# EAGLE design fasciaMainBoard_V0 (EAGLE 9.5.1)
NOVAXR-MAIN-BOARD: V1; REV: 1

## Sheet 1 of 2
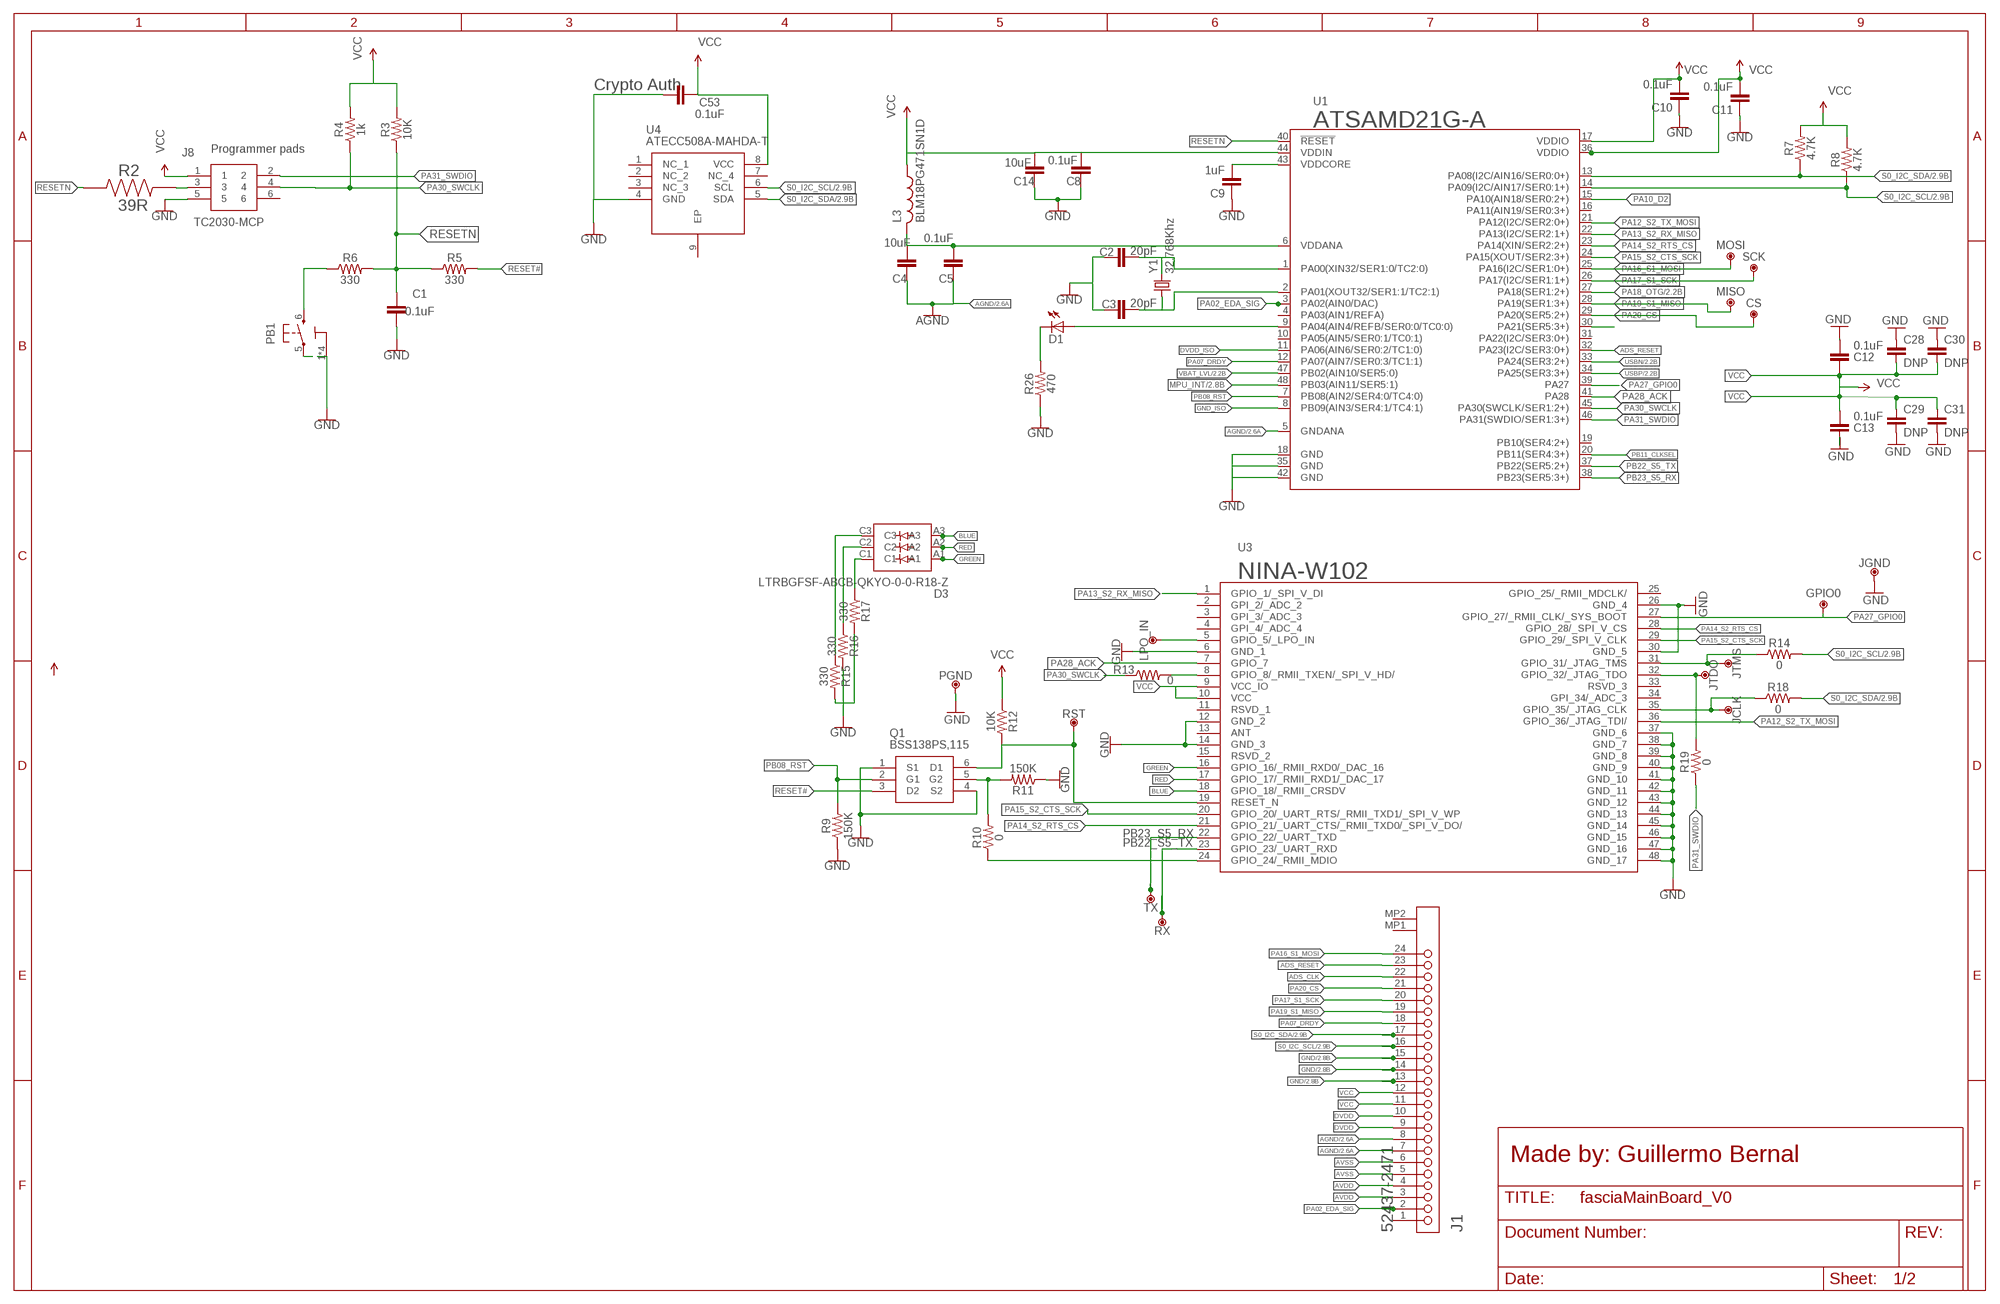
[diagram p0: schematic, sheet 1]
FRAME1 (FRAME_B_L): REV: 0

### Parts
C1  0.1uF  0.1UF-0402T-16V-10%  [0402-TIGHT]
C2  20pF  20PF-0402T-16V-10%  [0402-TIGHT]
C3  20pF  20PF-0402T-16V-10%  [0402-TIGHT]
C4  10uF  10UF-0603-6.3V-20%  [0603]
C5  0.1uF  0.1UF-0402T-16V-10%  [0402-TIGHT]
C8  0.1uF  0.1UF-0402T-16V-10%  [0402-TIGHT]
C9  1uF  1UF-0402T-16V-10%  [0402-TIGHT]
C10  0.1uF  0.1UF-0402T-16V-10%  [0402-TIGHT]
C11  0.1uF  0.1UF-0402T-16V-10%  [0402-TIGHT]
C12  0.1uF  0.1UF-0402T-16V-10%  [0402-TIGHT]
C13  0.1uF  0.1UF-0402T-16V-10%  [0402-TIGHT]
C14  10uF  10UF-0603-6.3V-20%  [0603]
C28  DNP  CDNP-0402  [0402-1005X55N]
C29  DNP  CDNP-0402  [0402-1005X55N]
C30  DNP  C-DNP-0603  [0603-1608X90N]
C31  DNP  C-DNP-0603  [0603-1608X90N]
C53  0.1uF  0.1UF-0402T-16V-10%  [0402-TIGHT]
CS  DNP  TPTP-0.8MM  [TP-0.8MM]
D1  LEDCHIPLED_0603  [CHIPLED_0603]
D3  LTRBGFSF-ABCB-QKYO-0-0-R18-Z  [PLCC-6]
GPIO0  DNP  TPTP-0.8MM  [TP-0.8MM]
J1  MOLEX_52437-2471MOLEX_52437-2471_0_0  [MOLEX_52437-2471_0]
J8  TC2030-MCP  [TC2030MCP]
JCLK  DNP  TPTP-0.8MM  [TP-0.8MM]
JGND  DNP  TPTP-0.8MM  [TP-0.8MM]
JTDO  DNP  TPTP-0.8MM  [TP-0.8MM]
JTMS  DNP  TPTP-0.8MM  [TP-0.8MM]
L3  BLM18PG471SN1D  [BEADC1608X95N]
LPO_IN  DNP  TPTP-0.8MM  [TP-0.8MM]
MISO  DNP  TPTP-0.8MM  [TP-0.8MM]
MOSI  DNP  TPTP-0.8MM  [TP-0.8MM]
PB1  PTS820  TACTILE1PTS820-NH  [C&K_PTS820_NO_HOLES]
PGND  DNP  TPTP-0.8MM  [TP-0.8MM]
Q1  BSS138PS,115  [SOT65P210X110-6N]
R2  39R  RC0402FR-0739RL  [RESC1005X40N]
R3  10K  [0402-TIGHT]
R4  1k  1K  [0402-TIGHT]
R5  330  [0402-TIGHT]
R6  330  [0402-TIGHT]
R7  4.7K  [0402-TIGHT]
R8  4.7K  [0402-TIGHT]
R9  150K  100K  [0402-TIGHT]
R10  0  [0402-TIGHT]
R11  150K  100K  [0402-TIGHT]
R12  10K  [0402-TIGHT]
R13  0  [0402-TIGHT]
R14  0  [0402-TIGHT]
R15  330  [0402-TIGHT]
R16  330  [0402-TIGHT]
R17  330  [0402-TIGHT]
R18  0  [0402-TIGHT]
R19  0  [0402-TIGHT]
R26  470  [0402-TIGHT]
RST  DNP  TPTP-0.8MM  [TP-0.8MM]
RX  DNP  TPTP-0.8MM  [TP-0.8MM]
SCK  DNP  TPTP-0.8MM  [TP-0.8MM]
TX  DNP  TPTP-0.8MM  [TP-0.8MM]
U1  ATSAMD21G-A  [TQFP-48]
U3  NINA-W102  [NINAW102]
U4  ATECC508A-MAHDA-T  [SON50P300X200X60-9N]
Y1  32.768Khz  ECS-.327-12.5-34B-TR  [ECX-31B]

### Nets
ADS_CLK: J1.22
ADS_RESET: J1.23 U1.32(PA23(I2C/SER3:0+))
AGND: C4.1 C5.1 J1.7 J1.8 U1.5(GNDANA) ; also sheet 2
AVDD: J1.3 J1.4 ; also sheet 2
AVSS: J1.5 J1.6 ; also sheet 2
BLUE: D3.A3 U3.18(GPIO_18/_RMII_CRSDV)
DVDD: J1.9 J1.10 ; also sheet 2
DVDD_ISO: U1.11(PA06(AIN6/SER0:2/TC1:0))
GND: C1.2 C2.1 C3.1 C8.1 C9.1 C10.1 C11.1 C12.2 C13.1 C14.1 C28.1 C29.2 C30.1 C31.2 C53.2 J1.13 J1.14 J1.15 J8.5 JGND.X PB1.1 PB1.2 PB1.3 PB1.4 PB1.5 PGND.X Q1.1(S1) Q1.4(S2) R9.1 R11.1 R15.2 R16.2 R17.2 R26.1 U1.18(GND) U1.35(GND) U1.42(GND) U3.6(GND_1) U3.12(GND_2) U3.14(GND_3) U3.26(GND_4) U3.30(GND_5) U3.37(GND_6) U3.38(GND_7) U3.39(GND_8) U3.40(GND_9) U3.41(GND_10) U3.42(GND_11) U3.43(GND_12) U3.44(GND_13) U3.45(GND_14) U3.46(GND_15) U3.47(GND_16) U3.48(GND_17) U4.4(GND) ; also sheet 2
GND_ISO: U1.8(PB09(AIN3/SER4:1/TC4:1))
GREEN: D3.A1 U3.16(GPIO_16/_RMII_RXD0/_DAC_16)
MPU_INT: U1.48(PB03(AIN11/SER5:1)) ; also sheet 2
N$1: J8.3 R2.2
N$3: PB1.6 R6.1
N$4: C2.2 U1.1(PA00(XIN32/SER1:0/TC2:0)) Y1.2
N$6: C3.2 U1.2(PA01(XOUT32/SER1:1/TC2:1)) Y1.1
N$8: Q1.5(G2) R10.2 R11.2
N$9: R10.1 U3.24(GPIO_24/_RMII_MDIO)
N$10: C9.2 U1.43(VDDCORE)
N$11: R13.2 U3.8(GPIO_8/_RMII_TXEN/_SPI_V_HD/)
N$12: Q1.6(D1) R12.2 RST.X U3.19(RESET_N)
N$13: D1.C R26.2
N$15: D1.A U1.9(PA04(AIN4/REFB/SER0:0/TC0:0))
N$16: D3.C1 R17.1
N$17: D3.C2 R16.1
N$18: D3.C3 R15.1
N$19: JTMS.X R14.1 U3.31(GPIO_31/_JTAG_TMS)
N$20: JTDO.X R19.2 U3.32(GPIO_32/_JTAG_TDO)
N$21: JCLK.X R18.1 U3.35(GPIO_35/_JTAG_CLK)
N$23: LPO_IN.X U3.5(GPIO_5/_LPO_IN)
PA02_EDA_SIG: J1.2 U1.3(PA02(AIN0/DAC))
PA07_DRDY: J1.18 U1.12(PA07(AIN7/SER0:3/TC1:1))
PA10_D2: U1.15(PA10(AIN18/SER0:2+))
PA12_S2_TX_MOSI: U1.21(PA12(I2C/SER2:0+)) U3.36(GPIO_36/_JTAG_TDI/)
PA13_S2_RX_MISO: U1.22(PA13(I2C/SER2:1+)) U3.1(GPIO_1/_SPI_V_DI)
PA14_S2_RTS_CS: U1.23(PA14(XIN/SER2:2+)) U3.21(GPIO_21/_UART_CTS/_RMII_TXD0/_SPI_V_DO/) U3.28(GPIO_28/_SPI_V_CS)
PA15_S2_CTS_SCK: U1.24(PA15(XOUT/SER2:3+)) U3.20(GPIO_20/_UART_RTS/_RMII_TXD1/_SPI_V_WP) U3.29(GPIO_29/_SPI_V_CLK)
PA16_S1_MOSI: J1.24 MOSI.X U1.25(PA16(I2C/SER1:0+))
PA17_S1_SCK: J1.20 SCK.X U1.26(PA17(I2C/SER1:1+))
PA18_OTG: U1.27(PA18(SER1:2+)) ; also sheet 2
PA19_S1_MISO: J1.19 MISO.X U1.28(PA19(SER1:3+))
PA20_CS: CS.X J1.21 U1.29(PA20(SER5:2+))
PA21_CS1: U1.30(PA21(SER5:3+))
PA27_GPIO0: GPIO0.X U1.39(PA27) U3.27(GPIO_27/_RMII_CLK/_SYS_BOOT)
PA28_ACK: U1.41(PA28) U3.7(GPIO_7)
PA30_SWCLK: J8.4 R4.1 R13.1 U1.45(PA30(SWCLK/SER1:2+))
PA31_SWDIO: J8.2 R19.1 U1.46(PA31(SWDIO/SER1:3+))
PB08_RST: Q1.2(G1) R9.2 U1.7(PB08(AIN2/SER4:0/TC4:0))
PB11_CLKSEL: U1.20(PB11(SER4:3+))
PB22_S5_TX: RX.X U1.37(PB22(SER5:2+)) U3.23(GPIO_23/_UART_RXD)
PB23_S5_RX: TX.X U1.38(PB23(SER5:3+)) U3.22(GPIO_22/_UART_TXD)
RED: D3.A2 U3.17(GPIO_17/_RMII_RXD1/_DAC_17)
RESET#: Q1.3(D2) R5.2
RESETN: C1.1 R2.1 R3.1 R5.1 R6.2 U1.40(!RESET!)
S0_I2C_SCL: J1.16 R8.1 R14.2 U1.14(PA09(I2C/AIN17/SER0:1+)) U4.6(SCL) ; also sheet 2
S0_I2C_SDA: J1.17 R7.1 R18.2 U1.13(PA08(I2C/AIN16/SER0:0+)) U4.5(SDA) ; also sheet 2
USBN: U1.33(PA24(SER3:2+)) ; also sheet 2
USBP: U1.34(PA25(SER3:3+)) ; also sheet 2
VBAT_LVL: U1.47(PB02(AIN10/SER5:0)) ; also sheet 2
VCC: C8.2 C10.2 C11.2 C12.1 C13.2 C14.2 C28.2 C29.1 C30.2 C31.1 C53.1 J1.11 J1.12 J8.1 L3.1 R3.2 R4.2 R7.2 R8.2 R12.1 U1.17(VDDIO) U1.36(VDDIO) U1.44(VDDIN) U3.9(VCC_IO) U3.10(VCC) U4.8(VCC) ; also sheet 2
VDDANA: C4.2 C5.2 L3.2 U1.6(VDDANA)
Unconnected: J1.1 J1.MP1 J1.MP2 J8.6 U1.4(PA03(AIN1/REFA)) U1.10(PA05(AIN5/SER0:1/TC0:1)) U1.16(PA11(AIN19/SER0:3+)) U1.19(PB10(SER4:2+)) U1.31(PA22(I2C/SER3:0+)) U3.2(GPI_2/_ADC_2) U3.3(GPI_3/_ADC_3) U3.4(GPI_4/_ADC_4) U3.11(RSVD_1) U3.13(ANT) U3.15(RSVD_2) U3.25(GPIO_25/_RMII_MDCLK/) U3.33(RSVD_3) U3.34(GPI_34/_ADC_3) U4.1(NC_1) U4.2(NC_2) U4.3(NC_3) U4.7(NC_4) U4.9(EP)

### Notes on the sheet
- Crypto Auth
- Programmer pads
- Made by: Guillermo Bernal

## Sheet 2 of 2
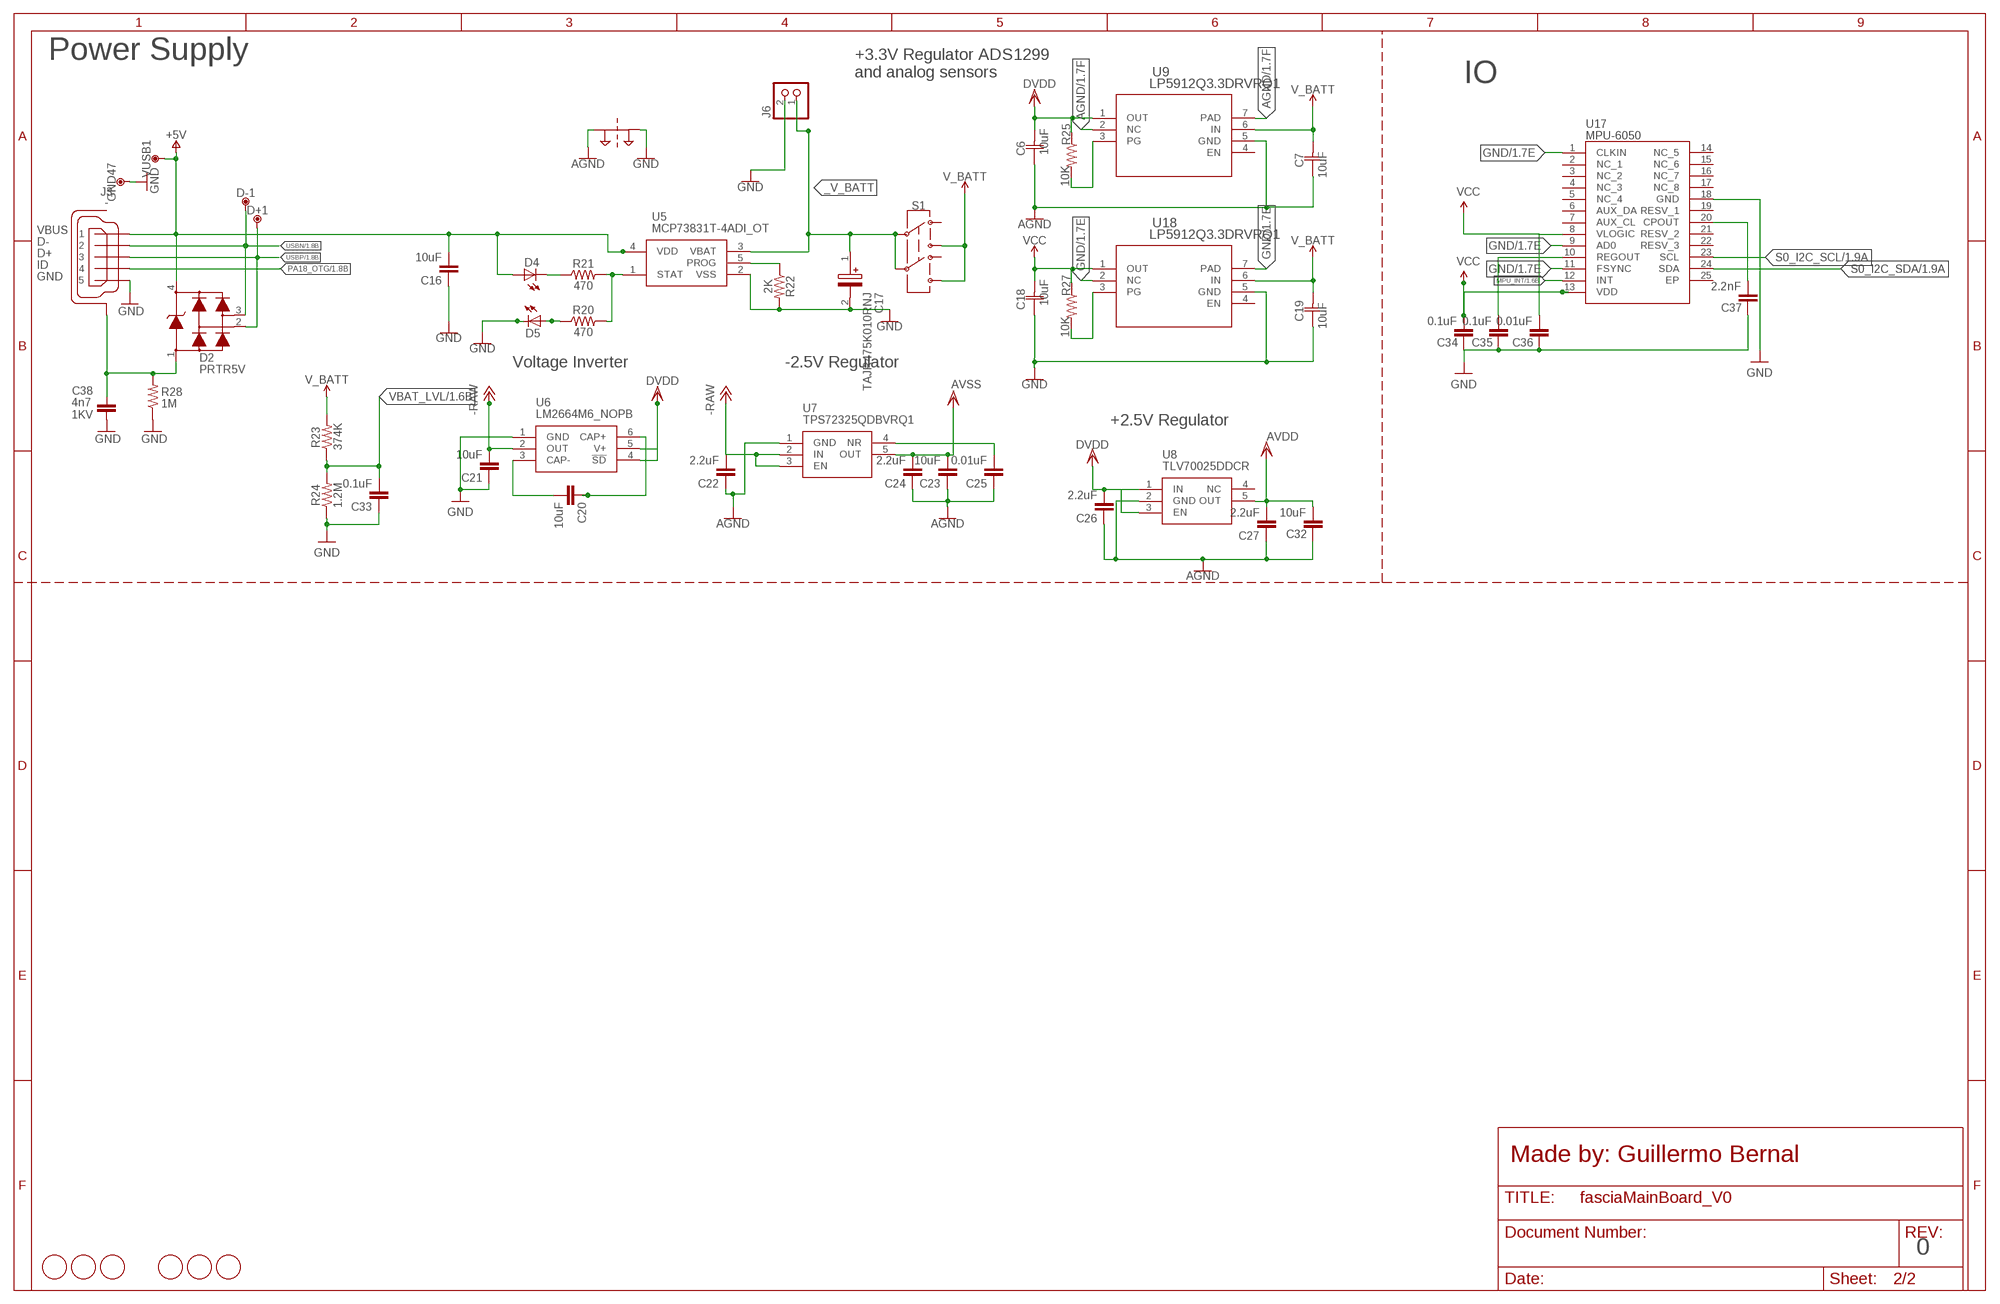
[diagram p1: schematic, sheet 2]
FRAME2 (FRAME_B_L): REV: 0

### Parts
C6  10uF  CL10B106MQ8NRNCCAP_CL10-L  [CAP_CL10-L]
C7  10uF  CL10B106MQ8NRNCCAP_CL10-L  [CAP_CL10-L]
C16  10uF  10UF-0603-6.3V-20%  [0603]
C17  TAJR475K010RNJ  [CAPPM2014X120N]
C18  10uF  CL10B106MQ8NRNCCAP_CL10-L  [CAP_CL10-L]
C19  10uF  CL10B106MQ8NRNCCAP_CL10-L  [CAP_CL10-L]
C20  10uF  10UF-0603-6.3V-20%  [0603]
C21  10uF  10UF-0603-6.3V-20%  [0603]
C22  2.2uF  2.2UF-0402T-16V-10%  [0402-TIGHT]
C23  10uF  10UF-0603-6.3V-20%  [0603]
C24  2.2uF  2.2UF-0402T-16V-10%  [0402-TIGHT]
C25  0.01uF  0.01UF-0402T-16V-10%  [0402-TIGHT]
C26  2.2uF  2.2UF-0402T-16V-10%  [0402-TIGHT]
C27  2.2uF  2.2UF-0402T-16V-10%  [0402-TIGHT]
C32  10uF  10UF-0603-6.3V-20%  [0603]
C33  0.1uF  0.1UF-0402T-16V-10%  [0402-TIGHT]
C34  0.1uF  0.1UF-0402T-16V-10%  [0402-TIGHT]
C35  0.1uF  0.1UF-0402T-16V-10%  [0402-TIGHT]
C36  0.01uF  0.01UF-0402T-16V-10%  [0402-TIGHT]
C37  2.2nF  2.2NF-0402T-16V-10%  [0402-TIGHT]
C38  4n7  C4.7NF-0805  [0805-R2013X50N]
D2  PRTR5V  PRTR5V0U2X,215  [SOT190P230X110-4N]
D4  LEDCHIPLED_0603  [CHIPLED_0603]
D5  LEDCHIPLED_0603  [CHIPLED_0603]
D+1  DNP  TPTP-1.00MM  [TP-1.00MM]
D-1  DNP  TPTP-1.00MM  [TP-1.00MM]
FD1  DNP  FIDUCIAL-1.5MM  [FD-1-1.5]
FD2  DNP  FIDUCIAL-1.5MM  [FD-1-1.5]
FD3  DNP  FIDUCIAL-1.5MM  [FD-1-1.5]
FD4  DNP  FIDUCIAL-1.5MM  [FD-1-1.5]
FD5  DNP  FIDUCIAL-1.5MM  [FD-1-1.5]
FD6  DNP  FIDUCIAL-1.5MM  [FD-1-1.5]
GND47  DNP  TPTP-1.00MM  [TP-1.00MM]
J3  -  USB-MICRO  [ZX62-AB-5PA]
J6  JST_2PIN-SMT-RA  [JST-PH-2-SMT-RA]
R20  470  [0402-TIGHT]
R21  470  [0402-TIGHT]
R22  2K  [0402-TIGHT]
R23  374K  [0402-TIGHT]
R24  1.2M  1.2M-0402-1/10W-1%  [0402]
R25  10K  [0402-TIGHT]
R27  10K  [0402-TIGHT]
R28  1M  [0402-TIGHT]
S1  SWITCH-DPDT-SMD-AYZ0202  [SWITCH_DPDT_SMD_AYZ0202]
SUPPLY1  2PT_GND_TIE  [2PT_GND_TIE]
U5  MCP73831T-4ADI_OT  [SOT95P270X145-5N]
U6  LM2664M6_NOPB  [SOT95P280X145-6N]
U7  TPS72325QDBVRQ1  [SOT96P230X110-5N]
U8  TLV70025DDCR  [SOT95P280X110-5N]
U9  LP5912Q3.3DRVRQ1  [DRV0006A]
U17  MPU-6050  [MPU6050]
U18  LP5912Q3.3DRVRQ1  [DRV0006A]
VUSB1  DNP  TPTP-1.00MM  [TP-1.00MM]

### Nets
+5V: C16.2 D2.4 D4.A J3.1 U5.4(VDD) VUSB1.X
-RAW: C21.2 C22.2 U6.2(OUT) U7.2(IN) U7.3(EN)
_V_BATT: C17.1(+) J6.1 S1.2 S1.5 U5.3(VBAT)
AGND: C6.1 C7.1 C22.1 C23.1 C24.1 C25.1 C26.1 C27.1 C32.1 SUPPLY1.P$1 U7.1(GND) U8.2(GND) U9.2(NC) U9.5(GND) U9.7(PAD) ; also sheet 1
AVDD: C27.2 C32.2 U8.5(OUT) ; also sheet 1
AVSS: C23.2 C24.2 U7.5(OUT) ; also sheet 1
DVDD: C6.2 C26.2 R25.1 U6.4(!SD) U6.5(V+) U8.1(IN) U8.3(EN) U9.1(OUT) ; also sheet 1
GND: C16.1 C17.2(-) C18.1 C19.1 C21.1 C33.1 C34.1 C35.1 C36.1 C37.1 C38.2 D5.C GND47.X J3.5 J6.2 R22.2 R24.1 R28.1 SUPPLY1.P$2 U5.2(VSS) U6.1(GND) U17.1(CLKIN) U17.9(AD0) U17.11(FSYNC) U17.18(GND) U18.2(NC) U18.5(GND) U18.7(PAD) ; also sheet 1
MPU_INT: U17.12(INT) ; also sheet 1
N$2: R27.2 U18.3(PG)
N$7: R25.2 U9.3(PG)
N$25: D4.C R21.1
N$28: R20.2 R21.2 U5.1(STAT)
N$30: R22.1 U5.5(PROG)
N$31: C20.2 U6.3(CAP-)
N$32: C20.1 U6.6(CAP+)
N$33: C25.2 U7.4(NR)
N$37: C35.2 U17.10(REGOUT)
N$39: C37.2 U17.20(CPOUT)
N$40: C38.1 D2.1 J3.6(SH) J3.7(SH) J3.8(SH) J3.9(SH) J3.10(SH) J3.11(SH) R28.2
N$42: D5.A R20.1
PA18_OTG: J3.4 ; also sheet 1
S0_I2C_SCL: U17.23(SCL) ; also sheet 1
S0_I2C_SDA: U17.24(SDA) ; also sheet 1
USBN: D2.3 D-1.X J3.2 ; also sheet 1
USBP: D2.2 D+1.X J3.3 ; also sheet 1
V_BATT: C7.2 C19.2 R23.2 S1.3 S1.6 U9.6(IN) U18.6(IN)
VBAT_LVL: C33.2 R23.1 R24.2 ; also sheet 1
VCC: C18.2 C34.2 C36.2 R27.1 U17.8(VLOGIC) U17.13(VDD) U18.1(OUT) ; also sheet 1
Unconnected: S1.1 S1.4 U8.4(NC) U9.4(EN) U17.2(NC_1) U17.3(NC_2) U17.4(NC_3) U17.5(NC_4) U17.6(AUX_DA) U17.7(AUX_CL) U17.14(NC_5) U17.15(NC_6) U17.16(NC_7) U17.17(NC_8) U17.19(RESV_1) U17.21(RESV_2) U17.22(RESV_3) U17.25(EP) U18.4(EN)

### Notes on the sheet
- Power Supply
- +3.3V Regulator ADS1299 
  and analog sensors
- IO
- Voltage Inverter | -2.5V Regulator
- +2.5V Regulator
- 374K
- Made by: Guillermo Bernal

## Library data of the parts
C1 C5 C8 C10-C13 C33-C35 C53 = novaXR:0.1UF: 0.1µF ceramic capacitors A capacitor is a passive two-terminal electrical component used to store electrical energy temporarily in an electric field.; PROD_ID: CAP-12416
C2 C3 = novaXR:20PF: 20pF ceramic capacitors A capacitor is a passive two-terminal electrical component used to store electrical energy temporarily in an electric field.; PROD_ID: CAP-12416; VALUE: 0.1uF
C4 C14 C16 C20 C21 C23 C32 = SparkFun-Capacitors:10UF: 10.0µF ceramic capacitors A capacitor is a passive two-terminal electrical component used to store electrical energy temporarily in an electric field.; PROD_ID: CAP-11015
C6 C7 C18 C19 = Lp5912Q3.3DRV:CL10B106MQ8NRNC; MANUFACTURER_PART_NUMBER: CL10B106MQ8NRNC; VENDOR: Samsung
C9 = novaXR:1UF: 1µF ceramic capacitors A capacitor is a passive two-terminal electrical component used to store electrical energy temporarily in an electric field.; PROD_ID: CAP-12416
C17 = SamacSys_Parts:TAJR475K010RNJ: AVX 4.7uF SMD Solid MnO2 Tantalum Electrolytic Capacitor, 10 V dc +/-10%, TAJ Series Source: Datasheet; ALLIED_NUMBER: 70475142; ALLIED_PRICE-STOCK: https://www.alliedelec.com/avx-tajr475k010rnj/70475142/; DESCRIPTION: AVX 4.7uF SMD Solid MnO2 Tantalum Electrolytic Capacitor, 10 V dc +/-10%, TAJ Series; HEIGHT: 1.2mm; MANUFACTURER_NAME: AVX; MANUFACTURER_PART_NUMBER: TAJR475K010RNJ; MOUSER_PART_NUMBER: 581-TAJR475K010R; MOUSER_PRICE-STOCK: https://www.mouser.com/Search/Refine.aspx?Keyword=581-TAJR475K010R; RS_PART_NUMBER: 1355409P; RS_PRICE-STOCK: http://uk.rs-online.com/web/p/products/1355409P
C22 C24 C26 C27 = novaXR:2.2UF: 2.2uF ceramic capacitors A capacitor is a passive two-terminal electrical component used to store electrical energy temporarily in an electric field.; PROD_ID: CAP-12416
C25 C36 = novaXR:0.01UF: 0.01µF ceramic capacitors A capacitor is a passive two-terminal electrical component used to store electrical energy temporarily in an electric field.; PROD_ID: CAP-12416
C28-C31 = Arduino-rcl:C: SMD Capacitor; CODE-ARDUINO: DNP; DATASHEET: DNP; DISTRIBUTOR-LINK: DNP; DISTRIBUTOR-PN: DNP; MANUFACTURER: DNP; MANUFACTURER-PN: DNP
C37 = novaXR:2.2NF: 2.2uF ceramic capacitors A capacitor is a passive two-terminal electrical component used to store electrical energy temporarily in an electric field.; PROD_ID: CAP-12416
C38 = Arduino-rcl:C: SMD Capacitor; CODE-ARDUINO: 0689; DATASHEET: http://www.kemet.com/Lists/ProductCatalog/Attachments/40/KEM_C1010_X7R_HV_SMD.pdf; DISTRIBUTOR-LINK: www.kemet.com/docfinder?Partnumber=C0805C472KDRACTU; DISTRIBUTOR-PN: 399-6738-1-ND; MANUFACTURER: Kemet; MANUFACTURER-PN: C0805C472KDRACTU; VOLTAGE: 1KV
CS D+1 D-1 GND47 GPIO0 JCLK JGND JTDO JTMS LPO_IN MISO MOSI PGND RST RX SCK TX VUSB1 = Arduino-utility:TP: Testpoint; CODE-ARDUINO: DNP; DATASHEET: DNP; DISTRIBUTOR-LINK: DNP; DISTRIBUTOR-PN: DNP; MANUFACTURER: DNP; MANUFACTURER-PN: DNP
D1 D4 D5 = adafruit:LED: LED OSRAM: - CHIPLED LG R971, LG N971, LY N971, LG Q971, LY Q971, LO R971, LY R971 LH N974, LH R974 LS Q976, LO Q976, LY Q976 LO Q996 - Hyper CHIPLED LW Q18S LB Q993, LB Q99A, LB R99A - SideLED LS A670, LO A670, LY A670, LG A670, LP A670 LB A673, LV A673, LT A673, LW A673 LH A674 LY A675 LS A676, LA A676, LO A676, LY A676, LW A676 LS A679, LY A679, LG A679 - Hyper Micro SIDELED® LS Y876, LA Y876, LO Y876, LY Y876 LT Y87S - SmartLED LW L88C, LW L88S LB L89C, LB L89S, LG L890 LS L89K, LO L89K, LY L89K LS L896, LA L896, LO L896, LY L896 - TOPLED LS T670, LO T670, LY T670, LG T670, LP T670 LSG T670, LSP T670, LSY T670, LOP T670, LYG T670 LG T671, LOG T671, LSG T671 LB T673, LV T673, LT T673, LW T673 LH T674 LS T676, LA T676, LO T676, LY T676, LB T676, LH T676, LSB T676, LW T676 LB T67C, LV T67C, LT T67C, LS T67K, LO T67K, LY T67K, LW E67C LS E67B, LA E67B, LO E67B, LY E67B, LB E67C, LV E67C, LT E67C LW T67C LS T679, LY T679, LG T679 LS T770, LO T770, LY T770, LG T770, LP T770 LB T773, LV T773, LT T773, LW T773 LH T774 LS E675, LA E675, LY E675, LS T675 LS T776, LA T776, LO T776, LY T776, LB T776 LHGB T686 LT T68C, LB T68C - Hyper Mini TOPLED® LB M676 - Mini TOPLED Santana® LG M470 LS M47K, LO M47K, LY M47K Source: http://www.osram.convergy.de/
D2 = Arduino-diodes:PRTR5V0U2X,215: USB ESD protection; CODE-ARDUINO: 2209; DATASHEET: http://www.nxp.com/documents/data_sheet/PRTR5V0U2X.pdf; DISTRIBUTOR-LINK: http://www.digikey.com/product-detail/en/nxp-semiconductors/PRTR5V0U2X,215/568-4140-1-ND/1589981; DISTRIBUTOR-PN: 568-4140-1-ND; MANUFACTURER: NXP; MANUFACTURER-PN: PRTR5V0U2X,215
D3 = SamacSys_Parts:LTRBGFSF-ABCB-QKYO-0-0-R18-Z: LED RGB DIFFUSED 6SMD Source: Datasheet; DESCRIPTION: LED RGB DIFFUSED 6SMD; HEIGHT: mm; MANUFACTURER_NAME: OSRAM Opto Semiconductors; MANUFACTURER_PART_NUMBER: LTRBGFSF-ABCB-QKYO-0-0-R18-Z; MOUSER_PART_NUMBER: N/A; MOUSER_PRICE-STOCK: https://www.mouser.com/Search/Refine.aspx?Keyword=N%2FA
FD1-FD6 = Arduino-utility:FIDUCIAL: Fiducial mount; CODE-ARDUINO: DNP; DATASHEET: DNP; DISTRIBUTOR-LINK: DNP; DISTRIBUTOR-PN: DNP; MANUFACTURER: DNP; MANUFACTURER-PN: DNP
J1 = Molex - 52437-2471:MOLEX_52437-2471: MOLX-52437-2471; CIIVA_IDS: 605212; CIRCUITS_LOADED: 24; COMPONENT_LINK_1_DESCRIPTION: Manufacturer URL; COMPONENT_LINK_1_URL: http://www.molex.com/molex/index.jsp; COMPONENT_LINK_3_DESCRIPTION: Package Specification; COMPONENT_LINK_3_URL: http://www.molex.com/pdm_docs/sd/524372471_sd.pdf; CONTACT_POSITION: Bottom; CURRENT_MAX_PER_CONTACT: 0.5A; DATASHEET: http://www.molex.com/webdocs/datasheets/pdf/en-us/0524372471_FFC_FPC_CONNECTORS.pdf; DURABILITY_MATING_CYCLES_MAX: 20; ENTRY_ANGLE: 90degrees Angle; FOOTPRINT_VARIANT_NAME_0: Manufacturer Recommended; IMPORTED: yes; IMPORTED_FROM: vault; IMPORT_TS: 1521869192; MATERIAL___METAL: Phosphor Bronze; MATERIAL___PLATING_MATING: Gold; MATERIAL___PLATING_TERMINATION: Gold; MF: Molex; MOUNTING_TECHNOLOGY: Surface Mount; MPN: 52437-2471; NUMBER_OF_ROWS: 1; ORIENTATION: Right Angle; PACKAGE: 52437-2471; PACKAGE_DESCRIPTION: 24-Lead FPC Connector, Pitch 0.5 mm; PACKAGE_VERSION: Rev. E, 07/2013; PACKING: Tape and Reel; PCB_LOCATOR: No; PCB_RETENTION: None; PITCH___MATING_INTERFACE: 0.50mm; POLARIZED_TO_PCB: Yes; PREFIX: J; RELEASE_DATE: 1411372502; ROHS: Yes; STACKABLE: No; VAULT_GUID: C435F480-C5D6-47A9-8B3E-1F527B5FE02A; VAULT_REVISION: D1E34D73-9D44-46B4-956C-D39459EFC8BE; VOLTAGE_MAX: 50V
J3 = Arduino-connectors:USB-MICRO: USB - micro AB USB 2.0 Receptacle Connector 5 Position Surface Mount, Right Angle, Horizontal; CODE-ARDUINO: 2219; DATASHEET: https://www.hirose.com/product/en/download_file/key_name/ZX/category/Catalog/doc_file_id/31704/?file_category_id=4&item_id=13&is_series=1; DISTRIBUTOR-LINK: http://www.digikey.com/product-detail/en/hirose-electric-co-ltd/ZX62-AB-5PA(31)/H125279CT-ND/5994741; DISTRIBUTOR-PN: H125279CT-ND; MANUFACTURER: Hirose; MANUFACTURER-PN: ZX62-AB-5PA(31)
J6 = adafruit:JST_2PIN: JST 2-Pin Connectors of various flavors SMT-RA (S2B-PH-SM4) 4UConnector #17311 SMT (B2B-PH-SM4) THM-RA (S2B-PH) THM (B2B-PH)
J8 = TC2030-MCP:TC2030-MCP: TC2030-MCP PCB FOOTPRINT,TC2030-MCP Source: Datasheet; ALLIED_NUMBER: 70547380; ALLIED_PRICE-STOCK: https://www.alliedelec.com/microchip-technology-inc-tc2030-mcp/70547380/; DESCRIPTION: TC2030-MCP PCB FOOTPRINT,TC2030-MCP; HEIGHT: 3mm; MANUFACTURER_NAME: Microchip; MANUFACTURER_PART_NUMBER: TC2030-MCP; MOUSER_PART_NUMBER: 579-TC2030-MCP; MOUSER_PRICE-STOCK: https://www.mouser.com/Search/Refine.aspx?Keyword=579-TC2030-MCP; RS_PART_NUMBER: 8252568; RS_PRICE-STOCK: http://uk.rs-online.com/web/p/products/8252568
L3 = SamacSys_Parts:BLM18PG471SN1D: Chip Ferrite Bead Source: Datasheet; DESCRIPTION: Chip Ferrite Bead; HEIGHT: 0.95mm; MANUFACTURER_NAME: Murata Electronics; MANUFACTURER_PART_NUMBER: BLM18PG471SN1D; MOUSER_PART_NUMBER: 81-BLM18PG471SN1D; MOUSER_PRICE-STOCK: https://www.mouser.com/Search/Refine.aspx?Keyword=81-BLM18PG471SN1D; RS_PART_NUMBER: 7241425P; RS_PRICE-STOCK: http://uk.rs-online.com/web/p/products/7241425P
PB1 = Arduino-pushbuttons:TACTILE1: Tactile Switch SPST-NO Top Actuated Surface Mount; CODE-ARDUINO: 0277; DATASHEET: http://www.ckswitches.com/media/1474/pts820.pdf; DISTRIBUTOR-LINK: https://www.digikey.com/product-detail/en/c-k/PTS820-J15M-SMTR-LFS/CKN10506CT-ND/4176681; DISTRIBUTOR-PN: PTS820 J25K SMTR LFS-ND; MANUFACTURER: C&K; MANUFACTURER-PN: PTS820 J25K SMTR LFS
Q1 = SamacSys_Parts:BSS138PS,115: Nexperia BSS138PS,115 Dual N-channel MOSFET, 320 mA, 60 V, 6-Pin SOT-363 Source: Datasheet; DESCRIPTION: Nexperia BSS138PS,115 Dual N-channel MOSFET, 320 mA, 60 V, 6-Pin SOT-363; HEIGHT: 1.1mm; MANUFACTURER_NAME: Nexperia; MANUFACTURER_PART_NUMBER: BSS138PS,115; MOUSER_PART_NUMBER: 771-BSS138PS115; MOUSER_PRICE-STOCK: https://www.mouser.com/Search/Refine.aspx?Keyword=771-BSS138PS115; RS_PART_NUMBER: 7920901P; RS_PRICE-STOCK: http://uk.rs-online.com/web/p/products/7920901P
R2 = RC0402FR-0739RL:RC0402FR-0739RL: Res Thick Film 0402 39 Ohm 1% 0.063W ?100ppm/?C Molded SMD Paper T/R; AVAILABILITY: Unavailable; DESCRIPTION: Surface Mount Thick Film Resistor, RC Series, 39 ohm, 63 mW, - 1%, 50 V, 0402 [1005 Metric]; MF: Yageo; MP: RC0402FR-0739RL; PACKAGE: 1005 Panasonic Electronic Components; PRICE: None
R3 R12 R25 R27 = novaXR:10K: 10KΩ resistor A resistor is a passive two-terminal electrical component that implements electrical resistance as a circuit element. Resistors act to reduce current flow, and, at the same time, act to lower voltage levels within circuits. - Wikipedia
R4 = novaXR:1K: 1KΩ resistor A resistor is a passive two-terminal electrical component that implements electrical resistance as a circuit element. Resistors act to reduce current flow, and, at the same time, act to lower voltage levels within circuits. - Wikipedia
R5 R6 R15-R17 = novaXR:330: 330Ω resistor A resistor is a passive two-terminal electrical component that implements electrical resistance as a circuit element. Resistors act to reduce current flow, and, at the same time, act to lower voltage levels within circuits. - Wikipedia
R7 R8 = novaXR:4.7K: 4.7KΩ resistor A resistor is a passive two-terminal electrical component that implements electrical resistance as a circuit element. Resistors act to reduce current flow, and, at the same time, act to lower voltage levels within circuits. - Wikipedia
R9 R11 = novaXR:100K: 150KΩ resistor A resistor is a passive two-terminal electrical component that implements electrical resistance as a circuit element. Resistors act to reduce current flow, and, at the same time, act to lower voltage levels within circuits. - Wikipedia
R10 R13 R14 R18 R19 = novaXR:0: 0Ω resistor A resistor is a passive two-terminal electrical component that implements electrical resistance as a circuit element. Resistors act to reduce current flow, and, at the same time, act to lower voltage levels within circuits. - Wikipedia
R20 R21 R26 = novaXR:470: 470Ω resistor A resistor is a passive two-terminal electrical component that implements electrical resistance as a circuit element. Resistors act to reduce current flow, and, at the same time, act to lower voltage levels within circuits. - Wikipedia
R22 = novaXR:2K: 2KΩ resistor A resistor is a passive two-terminal electrical component that implements electrical resistance as a circuit element. Resistors act to reduce current flow, and, at the same time, act to lower voltage levels within circuits. - Wikipedia
R23 = novaXR:374K: 374KΩ resistor A resistor is a passive two-terminal electrical component that implements electrical resistance as a circuit element. Resistors act to reduce current flow, and, at the same time, act to lower voltage levels within circuits. - Wikipedia
R24 = novaXR:1.2M: 1.2MΩ resistor A resistor is a passive two-terminal electrical component that implements electrical resistance as a circuit element. Resistors act to reduce current flow, and, at the same time, act to lower voltage levels within circuits. - Wikipedia
R28 = novaXR:1M: 1MΩ resistor A resistor is a passive two-terminal electrical component that implements electrical resistance as a circuit element. Resistors act to reduce current flow, and, at the same time, act to lower voltage levels within circuits. - Wikipedia
S1 = SparkFun-Switches:SWITCH-DPDT: Double-Pole, Double-Throw (DPDT) Switch Double-pole, double-throw switches. Variant Overview PTH-GPI-152-3013 Used on SparkFun Geiger Counter SMD-AY0202 Surface Mount DPDT Switch (COM-00597) Used on e.g. LilyPad Arduino USB - ATmega32U4 Board; PROD_ID: SWCH-08179; SF_SKU: COM-00597
SUPPLY1 = SparkFun-PowerSymbols:2PT_GND_TIE: Dual Ground Supply Power supply symbol for connecting two grounds. SparkFun Products: SparkFun AutoDriver - Stepper Motor Driver
U1 = SparkFun-IC-Microcontroller:ATSAMD21G: Atmel SAMD21G SMART ARM-Based Microcontroller The Atmel ® | SMART ™ SAM D21 is a series of low-power microcontrollers using the 32-bit ARM ® Cortex ® -M0+ processor, and ranging from 32- to 64-pins with up to 256KB Flash and 32KB of SRAM. The SAM D21 devices operate at a maximum frequency of 48MHz and reach 2.46 CoreMark/MHz. They are designed for simple and intuitive migration with identical peripheral modules, hex compatible code, identical linear address map and pin compatible migration paths between all devices in the product series. All devices include intelligent and flexible peripherals, Atmel Event System for inter-peripheral signaling, and support for capacitive touch button, slider and wheel user interfaces. Datasheet SparkFun Products SparkFun SAMD21 Mini Breakout (DEV-13664) SparkFun SAMD21 Dev Breakout (DEV-13672); PROD_ID: IC-13064
U3 = SamacSys_Parts:NINA-W102: STAND-ALONE MULTIRADIO MODULE Source: Datasheet; DESCRIPTION: STAND-ALONE MULTIRADIO MODULE; HEIGHT: 3mm; MANUFACTURER_NAME: U-Blox; MANUFACTURER_PART_NUMBER: NINA-W102
U4 = SamacSys_Parts:ATECC508A-MAHDA-T: Microchip ATECC508A-MAHDA-T 10kb 8-Pin Crypto Authentication IC UDFN Source: Datasheet; DESCRIPTION: Microchip ATECC508A-MAHDA-T 10kb 8-Pin Crypto Authentication IC UDFN; HEIGHT: 0.6mm; MANUFACTURER_NAME: Microchip; MANUFACTURER_PART_NUMBER: ATECC508A-MAHDA-T; MOUSER_PART_NUMBER: 556-ATECC508A-MAHDAT; MOUSER_PRICE-STOCK: https://www.mouser.com/Search/Refine.aspx?Keyword=556-ATECC508A-MAHDAT; RS_PART_NUMBER: 1773144P; RS_PRICE-STOCK: http://uk.rs-online.com/web/p/products/1773144P
U5 = SamacSys_Parts:MCP73831T-4ADI_OT: Battery Management Li-Ion/Li-Poly Charg Mgnt 4.4V Vreg out Source: Datasheet; ALLIED_NUMBER: 70567395; ALLIED_PRICE-STOCK: https://www.alliedelec.com/microchiptechnologyinc-mcp73831t-4adi-ot/70567395/; DESCRIPTION: Battery Management Li-Ion/Li-Poly Charg Mgnt 4.4V Vreg out; HEIGHT: 1.45mm; MANUFACTURER_NAME: Microchip; MANUFACTURER_PART_NUMBER: MCP73831T-4ADI/OT; MOUSER_PART_NUMBER: 579-MCP73831T4ADIOT; MOUSER_PRICE-STOCK: https://www.mouser.com/Search/Refine.aspx?Keyword=579-MCP73831T4ADIOT
U6 = SamacSys_Parts:LM2664M6_NOPB: 1.8V to 5.5Vin Switched Capacitor Voltage Converter Source: Datasheet; DESCRIPTION: 1.8V to 5.5Vin Switched Capacitor Voltage Converter; HEIGHT: 1.45mm; MANUFACTURER_NAME: Texas Instruments; MANUFACTURER_PART_NUMBER: LM2664M6/NOPB; MOUSER_PART_NUMBER: 926-LM2664M6/NOPB; MOUSER_PRICE-STOCK: https://www.mouser.com/Search/Refine.aspx?Keyword=926-LM2664M6%2FNOPB; RS_PART_NUMBER: 5358792P; RS_PRICE-STOCK: http://uk.rs-online.com/web/p/products/5358792P
U7 = SamacSys_Parts:TPS72325QDBVRQ1: Automotive Single Output LDO, 200mA, High PSRR, Low Noise Source: Datasheet; DESCRIPTION: Automotive Single Output LDO, 200mA, High PSRR, Low Noise; HEIGHT: 1.1mm; MANUFACTURER_NAME: Texas Instruments; MANUFACTURER_PART_NUMBER: TPS72325QDBVRQ1
U8 = SamacSys_Parts:TLV70025DDCR: 200-mA, Low-IQ, Low-Dropout Regulator for Portable Devices Source: Datasheet; DESCRIPTION: 200-mA, Low-IQ, Low-Dropout Regulator for Portable Devices; HEIGHT: mm; MANUFACTURER_NAME: Texas Instruments; MANUFACTURER_PART_NUMBER: TLV70025DDCR; MOUSER_PART_NUMBER: 595-TLV70025DDCR; MOUSER_PRICE-STOCK: https://www.mouser.com/Search/Refine.aspx?Keyword=595-TLV70025DDCR
U9 U18 = Lp5912Q3.3DRV:LP5912Q3.3DRVRQ1
U17 = SamacSys_Parts:MPU-6050: IMUs - Inertial Measurement Units 6-Axis MEMS MotionTracking Device with DMP Source: Datasheet; DESCRIPTION: IMUs - Inertial Measurement Units 6-Axis MEMS MotionTracking Device with DMP; HEIGHT: 3mm; MANUFACTURER_NAME: TDK; MANUFACTURER_PART_NUMBER: MPU-6050; MOUSER_PART_NUMBER: 410-MPU-6050
Y1 = SamacSys_Parts:ECS-.327-12.5-34B-TR: Crystals 32.768KHz 20ppm 12.5pF -40C +85C Source: Datasheet; DESCRIPTION: Crystals 32.768KHz 20ppm 12.5pF -40C +85C; HEIGHT: mm; MANUFACTURER_NAME: ECS; MANUFACTURER_PART_NUMBER: ECS-.327-12.5-34B-TR; MOUSER_PART_NUMBER: 520-327-12.5-34B; MOUSER_PRICE-STOCK: https://www.mouser.com/Search/Refine.aspx?Keyword=520-327-12.5-34B

## Net classes
0 default: width 0.19 mm, drill 0.19 mm
1 usb: width 0.19 mm, drill 0.19 mm, clearance 0.127 mm

## Board
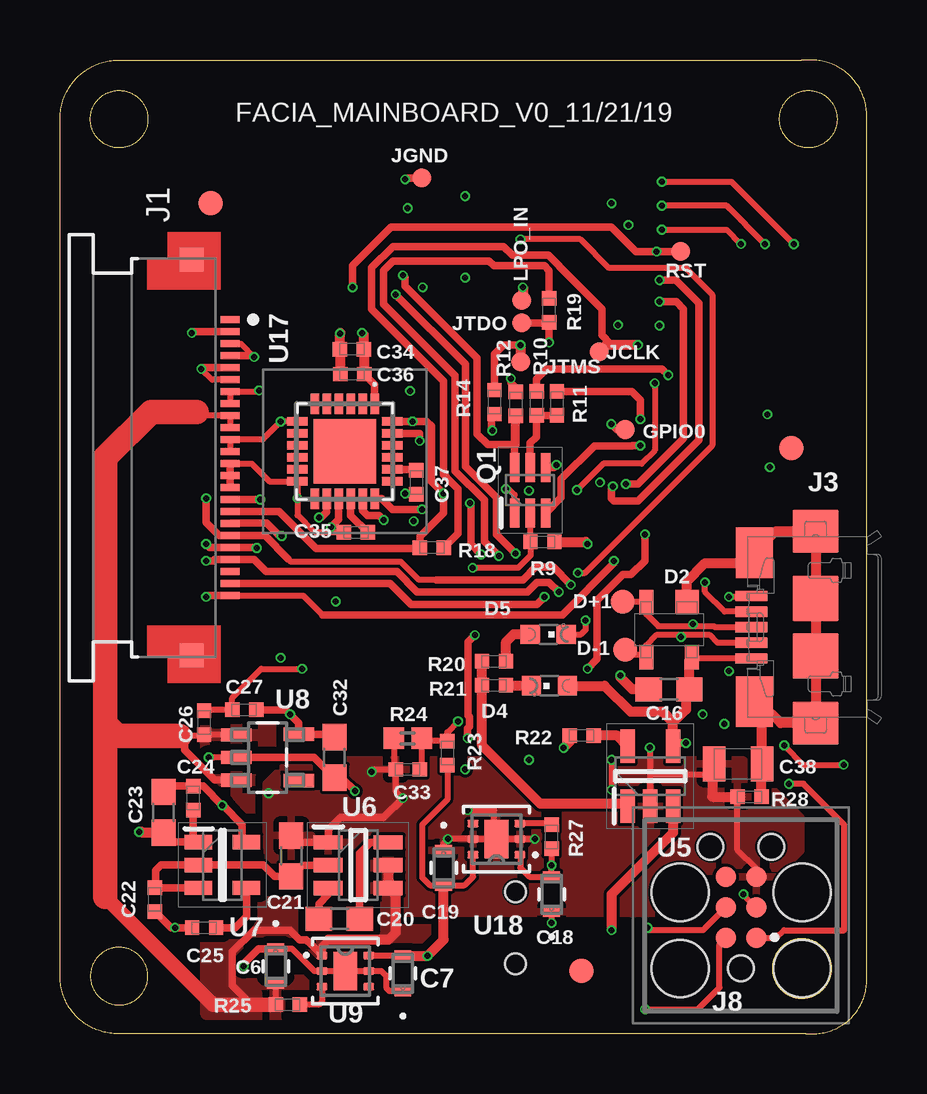
[diagram p2: board, top side]
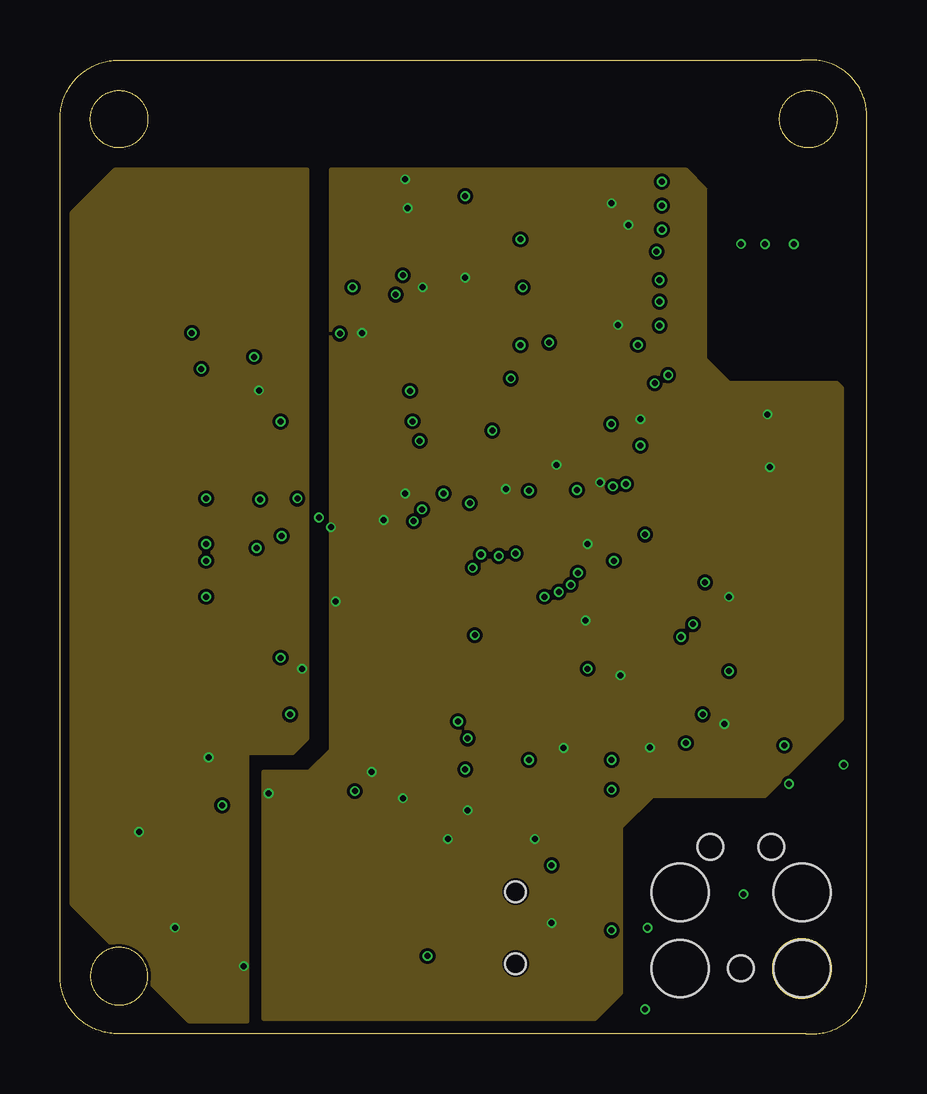
[diagram p3: board, inner layer Route2]
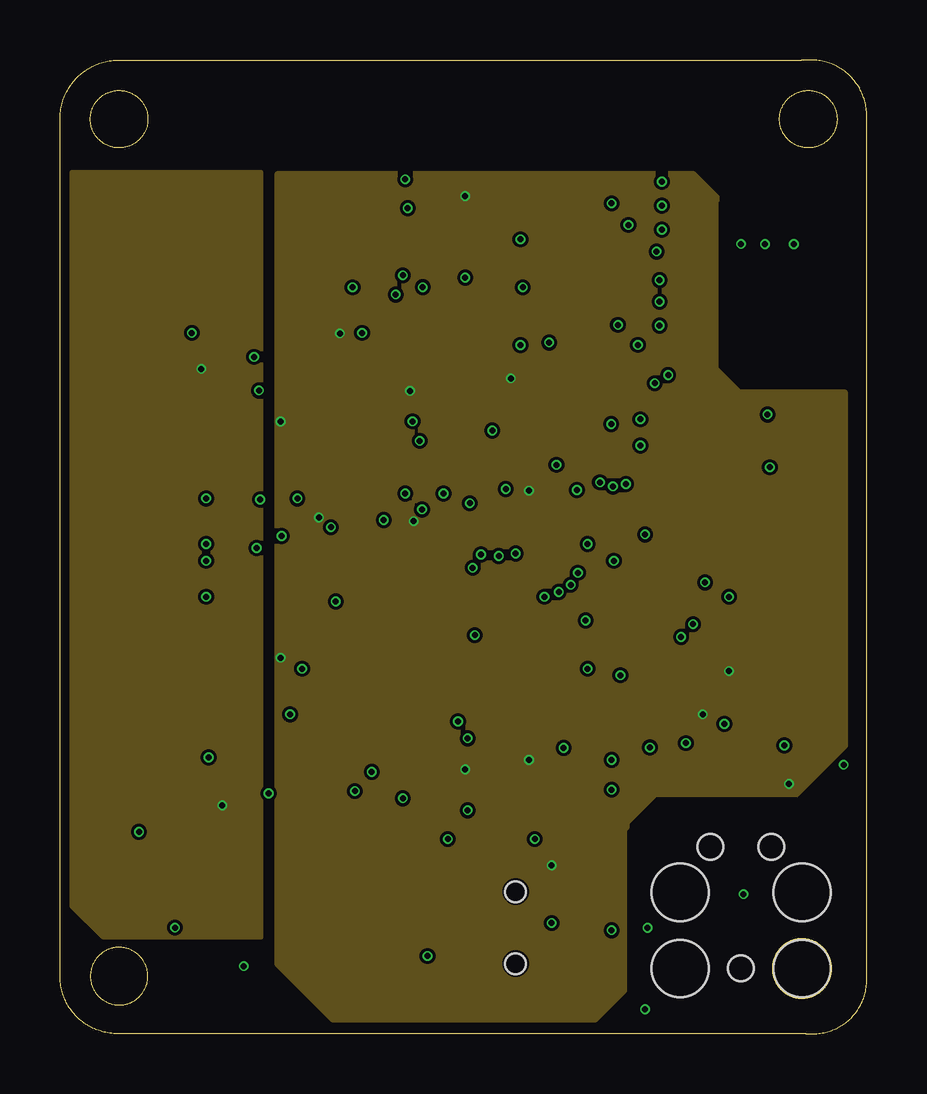
[diagram p4: board, inner layer Route15]
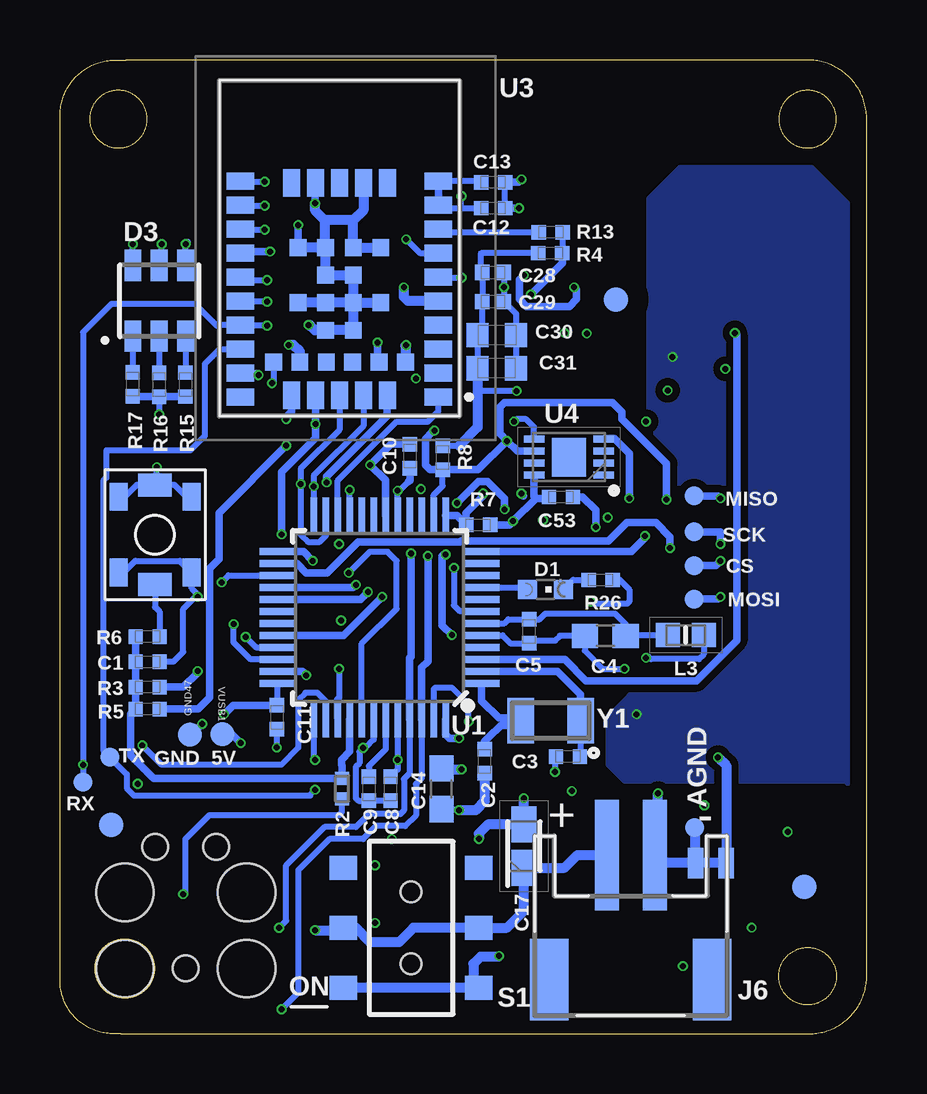
[diagram p5: board, bottom side, seen from below]

Size 33.63 x 40.59 mm. Coordinates in mm from the lower left corner, seen from the top.
Outline: 912 segments
Copper layers ([15:(1*2)+15*16]): Top 0.035mm / dielectric 0.213359375mm / Route2 0.035mm / dielectric 1.0161mm / Route15 0.035mm / dielectric 0.213359375mm / Bottom 0.035mm
Design rules "SparkFun-4-layer-PCBWAY-LIMIT *": minimum track width 5mil, minimum drill 0.2mm, track to track 5mil, track to pad 5mil, pad to pad 5mil, via to via 5mil, smd to smd 0mil, copper to edge 5mil, drill to drill 5mil, minimum pad ring 3mil, minimum via ring 3mil, stop-mask expansion 4mil, vias tented up to drill 25mil, thermal gap 10mil

### Footprints (pad centres in the part's own frame; a part is rotated, then mirrored left to right if it is on the bottom)
0402-TIGHT = smd 0.6 x 0.6: 1 -0.5,0; 2 0.5,0
0603 = smd 1.1 x 1: 1 -0.85,0; 2 0.85,0
CAP_CL10-L = smd 0.452 x 0.698: 1 -0.726,0; 2 0.726,0
CAPPM2014X120N = smd 1.5 x 1.05: 1 -0.9,0; 2 0.9,0
0402-1005X55N = smd 0.62 x 0.62: 1 -0.45,0; 2 0.45,0
0603-1608X90N = smd 0.95 x 1: 1 -0.8,0; 2 0.8,0
0805-R2013X50N = smd 0.95 x 1.45: 1 -1,0; 2 1,0
TP-0.8MM = smd 0.8 x 0.8 bottom: X 0,0
CHIPLED_0603 = smd 0.8 x 0.8: A 0,-0.75; C 0,0.75
SOT190P230X110-4N = smd 1 x 1: 1 -1.15,0.75 | smd 1 x 0.6: 2 -1.15,-0.95; 3 1.15,-0.95; 4 1.15,0.95
PLCC-6 = smd 1.3 x 0.7: A1 1.475,1.1; A2 1.475,0; A3 1.475,-1.1; C1 -1.475,1.1; C2 -1.475,0; C3 -1.475,-1.1
TP-1.00MM = smd 1 x 1 bottom: X 0,0
FD-1-1.5 = smd 1.016 x 1.016: P$1 0,0
MOLEX_52437-2471_0 = smd 0.3 x 0.8: 1 -5.75,0.8; 2 -5.25,0.8; 3 -4.75,0.8; 4 -4.25,0.8; 5 -3.75,0.8; 6 -3.25,0.8; 7 -2.75,0.8; 8 -2.25,0.8; 9 -1.75,0.8; 10 -1.25,0.8; 11 -0.75,0.8; 12 -0.25,0.8; 13 0.25,0.8; 14 0.75,0.8; 15 1.25,0.8; 16 1.75,0.8; 17 2.25,0.8; 18 2.75,0.8; 19 3.25,0.8; 20 3.75,0.8; 21 4.25,0.8; 22 4.75,0.8; 23 5.25,0.8; 24 5.75,0.8 | smd 1 x 1: MP1 -8.25,-0.8; MP2 8.25,-0.8
ZX62-AB-5PA = smd 0.4 x 1.35: 1 -1.3,3.025; 2 -0.65,3.025; 3 0,3.025; 4 0.65,3.025; 5 1.3,3.025 | smd 2.1 x 1.6: 6 3.1,2.9; 11 -3.1,2.9 | smd 1.8 x 1.9: 7 4,0.35; 10 -4,0.35 | smd 1.9 x 1.9: 8 1.2,0.35; 9 -1.2,0.35
JST-PH-2-SMT-RA = smd 1 x 4.6: 1 1,-3.7; 2 -1,-3.7 | smd 1.6 x 3.4: NC1 -3.4,1.5; NC2 3.4,1.5
TC2030MCP = smd 0.864 x 0.864: 1 -0.941,-0.635; 2 -0.941,0.635; 3 0.329,-0.635; 4 0.329,0.635; 5 1.599,-0.635; 6 1.599,0.635 | hole 1.067: -2.211,0; 2.869,1.27; 2.869,-1.27 | hole 2.383: -2.211,2.54; 0.964,2.54; -2.211,-2.54; 0.964,-2.54
BEADC1608X95N = smd 1 x 1: 1 -0.75,0; 2 0.75,0
C&K_PTS820_NO_HOLES = smd 1.15 x 0.75: 1 -1.575,1.525; 2 -1.575,-1.525; 3 1.575,1.525; 4 1.575,-1.525 | smd 0.95 x 1.4: 5 -2.075,0; 6 2.075,0
SOT65P210X110-6N = smd 1.2 x 0.4: 1 -0.95,0.65; 2 -0.95,0; 3 -0.95,-0.65; 4 0.95,-0.65; 5 0.95,0; 6 0.95,0.65
RESC1005X40N = smd 0.54 x 0.6: 1 -0.432,0; 2 0.432,0
0402 = smd 0.85 x 0.9: 1 -0.58,0; 2 0.58,0
SWITCH_DPDT_SMD_AYZ0202 = smd 1 x 1.15: 1 -2.5,2.825; 2 0,2.825; 3 2.5,2.825; 4 -2.5,-2.825; 5 0,-2.825; 6 2.5,-2.825 | hole 0.85: 1.5,0; -1.5,0
2PT_GND_TIE = smd 1.27 x 0.635: P$1 0,0.635; P$2 0,-0.635
TQFP-48 = smd 1.5 x 0.28: 1 -4.25,2.75; 2 -4.25,2.25; 3 -4.25,1.75; 4 -4.25,1.25; 5 -4.25,0.75; 6 -4.25,0.25; 7 -4.25,-0.25; 8 -4.25,-0.75; 9 -4.25,-1.25; 10 -4.25,-1.75; 11 -4.25,-2.25; 12 -4.25,-2.75; 25 4.25,-2.75; 26 4.25,-2.25; 27 4.25,-1.75; 28 4.25,-1.25; 29 4.25,-0.75; 30 4.25,-0.25; 31 4.25,0.25; 32 4.25,0.75; 33 4.25,1.25; 34 4.25,1.75; 35 4.25,2.25; 36 4.25,2.75 | smd 0.28 x 1.5: 13 -2.75,-4.25; 14 -2.25,-4.25; 15 -1.75,-4.25; 16 -1.25,-4.25; 17 -0.75,-4.25; 18 -0.25,-4.25; 19 0.25,-4.25; 20 0.75,-4.25; 21 1.25,-4.25; 22 1.75,-4.25; 23 2.25,-4.25; 24 2.75,-4.25; 37 2.75,4.25; 38 2.25,4.25; 39 1.75,4.25; 40 1.25,4.25; 41 0.75,4.25; 42 0.25,4.25; 43 -0.25,4.25; 44 -0.75,4.25; 45 -1.25,4.25; 46 -1.75,4.25; 47 -2.25,4.25; 48 -2.75,4.25
NINAW102 = smd 0.7 x 1.15: 1 -6.2,-3.875; 2 -5.2,-3.875; 3 -4.2,-3.875; 4 -3.2,-3.875; 5 -2.2,-3.875; 6 -1.2,-3.875; 7 -0.2,-3.875; 8 0.8,-3.875; 9 1.8,-3.875; 10 2.8,-3.875; 16 2.8,4.375; 17 1.8,4.375; 18 0.8,4.375; 19 -0.2,4.375; 20 -1.2,4.375; 21 -2.2,4.375; 22 -3.2,4.375; 23 -4.2,4.375; 24 -5.2,4.375; 25 -6.2,4.375 | smd 1.15 x 0.7: 11 2.725,-1.75; 12 2.725,-0.75; 13 2.725,0.25; 14 2.725,1.25; 15 2.725,2.25; 26 -6.125,2.25; 27 -6.125,1.25; 28 -6.125,0.25; 29 -6.125,-0.75; 30 -6.125,-1.75 | smd 0.7 x 0.7: 31 -4.75,-2.5; 32 -4.75,-1.4; 33 -4.75,-0.3; 34 -4.75,0.8; 35 -4.75,1.9; 36 -4.75,3; 37 -3.42,-0.325; 38 -3.42,0.825; 39 -2.27,-1.475; 40 -2.27,-0.325; 41 -2.27,0.825; 42 -2.27,1.975; 43 -1.12,-0.325; 44 -1.12,0.825; 45 0.03,-1.475; 46 0.03,-0.325; 47 0.03,0.825; 48 0.03,1.975
SON50P300X200X60-9N = smd 0.85 x 0.3: 1 -1.45,0.75; 2 -1.45,0.25; 3 -1.45,-0.25; 4 -1.45,-0.75; 5 1.45,-0.75; 6 1.45,-0.25; 7 1.45,0.25; 8 1.45,0.75 | smd 1.4 x 1.6: 9 0,0
SOT95P270X145-5N = smd 1.4 x 0.6: 1 -1.25,0.95; 2 -1.25,0; 3 -1.25,-0.95; 4 1.25,-0.95; 5 1.25,0.95
SOT95P280X145-6N = smd 1.2 x 0.6: 1 -1.25,0.95; 2 -1.25,0; 3 -1.25,-0.95; 4 1.25,-0.95; 5 1.25,0; 6 1.25,0.95
SOT96P230X110-5N = smd 1.15 x 0.6: 1 -1,0.955; 2 -1,0; 3 -1,-0.955; 4 1,-0.955; 5 1,0.955
SOT95P280X110-5N = smd 1.27 x 0.559: 1 -1.295,0.94; 2 -1.295,0; 3 -1.295,-0.94; 4 1.295,-0.965; 5 1.295,0.965
DRV0006A = smd 0.457 x 0.305: 1 -0.975,0.65; 2 -0.975,0; 3 -0.975,-0.65; 4 0.975,-0.65; 5 0.975,0; 6 0.975,0.65 | smd 0.991 x 1.6: 7 0,0
MPU6050 = smd 0.85 x 0.35: 1 -1.975,1.25; 2 -1.975,0.75; 3 -1.975,0.25; 4 -1.975,-0.25; 5 -1.975,-0.75; 6 -1.975,-1.25; 7 1.975,-1.25; 8 1.975,-0.75; 9 1.975,-0.25; 10 1.975,0.25; 11 1.975,0.75; 12 1.975,1.25 | smd 0.35 x 0.85: 13 -1.25,-1.975; 14 -0.75,-1.975; 15 -0.25,-1.975; 16 0.25,-1.975; 17 0.75,-1.975; 18 1.25,-1.975; 19 1.25,1.975; 20 0.75,1.975; 21 0.25,1.975; 22 -0.25,1.975; 23 -0.75,1.975; 24 -1.25,1.975 | smd 2.7 x 2.6: 25 0,0
ECX-31B = smd 1.1 x 1.9: 1 -1.25,0; 2 1.25,0

### Placement (x,y rotation side)
C1  29.98,15.51 0 bottom
C2  15.93,11.35 90 bottom
C3  12.46,11.55 0 bottom
C4  10.9,16.58 0 bottom
C5  14.07,16.77 90 bottom
C6  9,2.81 270 top
C7  14.29,2.52 90 top
C8  19.85,10.21 90 bottom
C9  20.75,10.21 90 bottom
C10  19.04,24.08 270 bottom
C11  24.58,13.19 90 bottom
C12  15.57,34.41 0 bottom
C13  15.57,35.49 180 bottom
C14  17.73,10.21 90 bottom
C16  25.39,14.35 0 top
C17  14.29,7.82 90 bottom
C18  20.5,5.81 90 top
C19  16,6.91 270 top
C20  11.65,4.79 180 top
C21  9.64,7.41 270 top
C22  3.95,5.59 90 top
C23  4.32,9.23 90 top
C24  5.56,9.82 90 top
C25  6.01,4.42 0 top
C26  6.01,12.97 270 top
C27  7.68,13.5 0 top
C28  15.57,31.73 180 bottom
C29  15.57,30.52 0 bottom
C30  15.42,29.12 180 bottom
C31  15.42,27.74 0 bottom
C32  11.45,11.52 90 top
C33  14.5,11.02 0 top
C34  12.17,28.53 180 top
C35  12.33,20.9 0 top
C36  12.19,27.5 180 top
C37  14.86,22.98 90 top
C38  28.27,11.25 180 top
C53  12.75,22.37 0 bottom
CS  7.2,19.52 0 top
D1  13.39,18.52 270 bottom
D2  25.39,16.84 270 top
D3  29.49,30.55 90 bottom
D4  20.41,14.5 90 top
D5  20.36,16.65 270 top
D+1  23.46,18.01 270 bottom
D-1  23.56,16.01 270 bottom
FD1  6.27,34.62 180 top
FD2  21.74,2.63 180 top
FD3  10.46,30.61 180 bottom
FD4  30.5,24.41 0 top
FD5  31.5,8.71 0 bottom
FD6  2.59,6.11 0 bottom
GND47  28.21,12.47 270 top
GPIO0  23.57,25.19 90 bottom
J1  6.29,24.02 270 top
J3  31.85,16.95 90 top
J6  9.84,3.75 180 bottom
J8  28.39,4.93 90 top
JCLK  22.48,28.43 270 bottom
JGND  15.09,35.67 270 bottom
JTDO  19.24,29.63 270 bottom
JTMS  19.21,28.01 270 bottom
L3  7.55,16.62 180 bottom
LPO_IN  19.24,30.57 270 bottom
MISO  7.2,22.41 0 top
MOSI  7.2,18.12 0 top
PB1  29.67,20.8 270 bottom
PGND  7.17,8.59 180 top
Q1  19.6,22.66 90 top
R2  21.87,10.22 270 bottom
R3  29.98,14.45 0 bottom
R4  13.19,32.54 180 bottom
R5  29.98,13.53 0 bottom
R6  29.98,16.56 180 bottom
R7  16.19,21.21 0 bottom
R8  17.68,24.02 90 bottom
R9  20.11,20.5 180 top
R10  19.87,26.28 270 top
R11  20.72,26.28 270 top
R12  19,26.25 270 top
R13  13.17,33.41 180 bottom
R14  18.11,26.33 270 top
R15  28.4,27.06 270 bottom
R16  29.5,27.05 270 bottom
R17  30.6,27.07 270 bottom
R18  15.5,20.26 180 top
R19  20.39,30.16 270 top
R20  18.09,15.53 180 top
R21  18.09,14.52 180 top
R22  21.74,12.43 180 top
R23  16.15,11.7 270 top
R24  14.5,12.32 0 top
R25  9.5,1.21 0 top
R26  11.1,18.91 180 bottom
R27  20.5,8.21 90 top
R28  28.75,9.88 0 top
RST  25.87,32.61 180 bottom
RX  31.56,11.52 180 top
S1  19,4.41 270 bottom
SCK  7.2,20.91 0 top
SUPPLY1  6.5,7.11 270 bottom
TX  32.67,10.49 180 top
U1  20.3,17.35 180 bottom
U3  21.73,32.74 90 bottom
U4  12.41,24.04 180 bottom
U5  24.61,10.73 90 top
U6  12.43,7.03 0 top
U7  6.77,7.03 0 top
U8  8.65,11.52 0 top
U9  11.89,2.61 0 top
U17  11.87,24.28 270 top
U18  18.19,8.11 180 top
VUSB1  26.86,12.48 270 top
Y1  13.18,13.05 180 bottom

### Tracks (layer width: path | path; a pad name or v marks a point on that pad's centre or on a via)
+5V  (via drill 0.25)
  Top 0.254: J3.1 26.29,15.65 26.24,15.59
  Top 0.305: U5.4 25.69,12.11 v26.1,12.11
  Top 0.406: D4.A 22.71,14.5 23.79,13.41 25.13,13.41 25.56,12.98 | D2.4 26.24,15.59 C16.2 26.1,14.21 26.1,13.52 25.56,12.98 | U5.4 25.56,12.98
  Bottom 0.305: v26.1,12.11 26.46,12.48 VUSB1.X
-RAW
  Top 0.305: 3.97,6.08 C22.2 4,6.13 | 4,6.13 4,6.81 4.21,7.03 U7.2 8.48,7.03 8.95,6.56 C21.2 10.11,7.03 U6.2 | U7.3 4.05,6.08 4,6.13
_V_BATT  (via drill 0.25)
  Top 0.406: U5.3 25.56,8.38 23,5.81 v23,4.31
  Bottom 0.406: J6.1 12.06,7.45 12.59,6.92 C17.1 14.29,5.12 15,4.41 S1.2 18.89,4.41 19.5,3.81 20.69,3.81 21.29,4.41 S1.5 21.92,4.31 v23,4.31
ADS_RESET  (via drill 0.25)
  Top 0.305: J1.23 13.76,18.77 14.63,17.9 19.88,17.9 v20.19,18.21
  Bottom 0.305: U1.32 21.81,16.6 v20.19,18.21
AGND  (via drill 0.25)
  Top 0.254: J1.8 J1.7 8.29,26.77 v8.29,26.81 | C26.1 6.04,13.5 C27.1 7.18,14 8.39,15.21 v10.1,15.21 | U8.2 6.4,11.52 6.39,11.52 v6.2,11.52 | C7.1 13.72,1.79 13.6,1.91 13.6,2.41 13.39,2.61 U9.5 U9.7 U9.2 10.6,2.61 9.67,3.54 C6.1
  Top 0.305: v12.29,10.11 11.74,10.67 C32.1 10.6,11.52 U8.2 | C25.1 v4.79,4.42 4.63,4.42 C22.1 | U7.1 5.7,7.99 | 5.7,7.99 4.71,7.99 C23.1 | C24.1 5.56,8.12 5.7,7.99 | C6.1 8.29,3.54 7.66,2.91 v7.66,2.81
  Top 0.406: C23.1 3.43,8.38 3.39,8.41 v3.29,8.41
  Bottom 0.254: U1.5 15.18,16.6 14.86,16.27 C5.1 13.96,16.38 13,16.38 12.79,16.58 C4.1 11.75,15.97 11,15.21 v10.1,15.21
  Bottom 0.406: v6.2,11.52 5.86,11.18 SUPPLY1.P$1
  pour Route2: 10.29,36.02 10.29,12.31 9.69,11.71 7.79,11.71 7.79,0.51 5.39,0.51 0.5,5.41 0.5,34.21 2.29,36.02
AVDD  (via drill 0.25)
  Top 0.254: J1.3 7.54,28.77 v8.09,28.21
  Top 0.305: J1.4 8.04,28.27 v8.09,28.21 | C32.2 11.33,12.48 U8.5 9.95,12.96 v9.6,13.31 9.41,13.5 C27.2
  pour Bottom (isolate 0.305): 2.29,36.12 7.79,36.12 9.1,34.81 9.1,14.91 10.79,13.21 10.79,11.21 10.1,10.52 0.89,10.52 0.79,10.41 0.79,34.62
AVSS  (via drill 0.25)
  Top 0.254: J1.6 6.34,27.27 v5.89,27.71
  Top 0.305: C23.2 4.56,10.32 C24.2 5.96,10.32 v6.77,9.52 6.79,9.52 7.59,8.71 7.59,8.17 U7.5 | J1.5 5.95,27.77 v5.89,27.71
  pour Route15: 8.39,4.02 8.39,35.91 0.5,35.91 0.5,5.31 1.79,4.02
BLUE  (via drill 0.25)
  Top 0.254: v25.1,33.52 27.79,33.52 v28.39,32.92
  Bottom 0.254: U3.18 26.08,33.52 v25.1,33.52 | D3.A3 v28.39,32.92 | v28.39,32.92 28.29,33.02 v28.39,32.92
DVDD
  Top 0.254: J1.10 J1.9 5.84,25.77 5.7,25.91 | U8.1 6.03,12.46 C26.2 5.95,12.41 5.2,12.41 5,12.41 | C6.2 R25.1
  Top 0.305: 11.19,3.91 10.92,3.64 U9.1 10.48,3.7 10.27,3.91 10,3.91 9.6,4.31 8.09,4.31 7.18,3.4 7.18,2.02 8,1.21 R25.1 | U8.3 6.45,10.58 5.2,11.84 5.2,12.41
  Top 0.406: U6.5 U6.4 14,5.77 14,4.21 13.69,3.91 11.19,3.91
  Top 0.61: R25.1 6.39,1.21 1.89,5.71
  Top 1.016: 5.7,25.91 3.79,25.91 1.89,24.02 1.89,15.02 1.89,12.91 | 1.89,12.91 2.39,12.41 5,12.41 | 1.89,5.71 1.89,12.91
  pour Top (isolate 0.305, rank 2): 23.19,0.81 6.09,0.81 6.09,13.81 23.19,13.81
GND  (via drill 0.25)
  Top 0.254: J1.13 8,23.77 8.73,23.03 U17.18 v9.9,22.31 9.9,21.61 10.6,20.91 11.29,20.91 | 11.69,20.81 11.69,20.9 C35.1 11.31,20.9 11.29,20.91 | v11.29,21.12 11.29,20.91 | C18.1 v20.5,4.61 | v19.79,8.11 U18.2 U18.7 | C19.1 16,7.94 v16.17,8.11 U18.5 U18.7 | J3.5 28.8,18.21 v27.89,18.21 | J8.5 29.03,6.88 28.25,7.66 R28.1 | Q1.1 18.95,22.46 18.69,22.71 v18.6,22.71 v18.59,22.71 | v13,10.91 13.1,11.02 C33.1 | R24.1 13.92,11.1 C33.1 | C33.1 14,10.11 v14.29,9.81 | U5.2 24.6,9.5 v24.6,11.93 24.6,10.81 27.19,10.81 | U18.7 18.1,8.21 18.1,9.31 v17,9.31 | v21.91,17.23 21.91,16.84 21.72,16.65 D5.C
  Top 0.305: v20.69,23.71 20.59,23.61 Q1.4 | C21.1 9.92,7.98 U6.1 11.19,7.99 11.19,8.52 11.69,9.02 13.5,9.02 v14.29,9.81 | C37.1 14.43,22.48 v14.39,22.52 | C36.1 13.12,27.06 U17.1 | R11.1 23.83,26.78 24.19,26.41 v24.19,25.62 | U17.9 11.62,21.44 v11.29,21.12 | v13.5,21.41 13.31,21.6 12.83,21.6 12.62,21.81 U17.11 | J1.13 J1.14 J1.15 | v14.39,35.62 14.45,35.67 JGND.X | v23.36,14.95 v23.37,14.94
  Top 0.406: C38.2 27.19,11.18 27.19,10.81 27.19,9.88 R28.1 | C16.1 23.86,14.35 23.37,14.84 v23.37,14.94 | R22.2 21.24,12.16 v21,11.91 | C36.1 12.67,27.51 C34.1 12.67,29.14 v12.6,29.21 | R9.1 21.91,20.5 v22,20.41
  Bottom 0.19: SUPPLY1.P$2 7.13,7.65
  Bottom 0.254: PB1.3 28.14,18.56 27.89,18.31 v27.89,18.21 28,18.21 28.5,17.71 28.5,15.91 28.89,15.52 C1.2 | PB1.3 | C28.1 v15.12,31.12 C29.2 14.62,30.02 C30.1 C31.2 | U3.6 17.83,31.52 v16.89,31.52 | C12.2 C13.1 | C8.1 C9.1 21.19,9.71 21.31,9.83 21.31,11.11 21.15,11.27 21.15,11.76 v21,11.91 20.89,11.91 20.55,12.26 U1.42 | C3.1 13,11.51 v13,10.91 | C11.1 24.6,12.68 v24.6,11.93 | C14.1 17.04,9.36 v17,9.31 | R26.1 10.29,18.91 9.89,18.52 9.89,18.02 10,17.91 11.5,17.91 v11.5,18.02 | R16.2 v29.5,25.82 v29.5,25.81 | PB1.1 28.36,22.38 28.86,22.88 PB1.5 | PB1.5 30.43,22.88 30.93,22.38 PB1.2 | PB1.5 29.6,22.95 v29.6,23.62 | PB1.4 30.98,19.23 30.5,19.71 28.64,19.71 PB1.3
  Bottom 0.305: R15.2 R16.2 30.58,26.55 R17.2 | C53.2 11.85,22.37 11.29,21.82 v11.29,21.12 | U1.18 20.05,23.07 v20.69,23.71 19.83,24.58 C10.1 | U3.26 23.98,25.93 24.19,25.71 v24.19,25.62 | U3.48 v23.71,33.7 v23.69,33.71 | U3.14 23,35.45 v23,34.62 | GND47.X 28.14,12.47 v27.69,12.91 | U1.35 23.52,15.1 v23.36,14.95 | v14.39,22.52 14.3,22.42 | U4.4 10.93,24.81 10.52,24.81 9.89,24.19 v9.89,22.31 v9.9,22.31 | U3.30 20,26.6 20,25.74 22.51,23.22 v22.51,22.98 | C12.2 v14.5,34.41 | v15.12,31.12 | C13.1 14.52,35.49 v14.39,35.62
  Bottom 0.406: SUPPLY1.P$2 8.5,7.11 J6.2 8.84,9.17 8.69,9.31 v8.69,10.02 | v14.29,9.81 C17.2 15.79,8.72 16.17,8.34 v16.17,8.11 | C2.1 15.93,9.68 16.29,9.31 v17,9.31 | PGND.X 7.17,7.68 7.13,7.65 | U3.12 20.98,34.33 21.41,33.9 | 21.41,33.9 U3.46 U3.45 | 21.41,33.9 21.42,33.91 22.6,33.91 | 22.6,33.91 23,34.31 v23,34.62 | 22.6,33.91 22.6,32.81 U3.47 | U3.47 U3.48 | U3.40 U3.43 U3.44 U3.47 | U3.40 U3.41 U3.42 | U3.40 U3.39 | U3.40 U3.37 U3.38 23,29.32 23.22,29.54 v23.27,29.54
  pour Route2: 32.39,27.12 27.89,27.12 26.89,28.12 26.89,35.21 26.1,36.02 11.29,36.02 11.29,11.81 10.39,10.91 8.5,10.91 8.5,0.61 22.29,0.61 23.39,1.71 23.39,8.61 24.69,9.91 29.39,9.91 32.59,13.11 32.59,26.91
  pour Top: 8.69,7.41 8.69,6.21 9.89,5.02 28.29,5.02 30.89,7.61 30.89,9.02 28.5,11.41 9.6,11.41 8.6,10.41 8.6,7.61 8.69,7.52
GREEN  (via drill 0.25)
  Top 0.254: v25.1,35.52 28,35.52 v30.6,32.91
  Bottom 0.254: U3.16 26.08,35.52 v25.1,35.52 | D3.A1 v30.59,32.91 v30.6,32.91
MPU_INT  (via drill 0.25)
  Top 0.305: v17,12.31 17,12.73 17.08,12.82 17.08,13.21 17.01,13.27 17.01,16.34 v17.29,16.61 | v17.55,19.98 17.13,20.4 17.13,22.12 v17.08,22.12 | v15.1,21.86 13.85,21.86 13.41,22.3 U17.12
  Bottom 0.305: U1.48 17.55,12.47 17.39,12.31 v17,12.31 | v17.29,16.61 17.69,17.02 17.69,19.91 17.64,19.98 v17.55,19.98 | v17.08,22.12 16.18,23.02 15.81,23.02 15.1,22.3 v15.1,21.86
N$1  (via drill 0.25)
  Top 0.254: J8.3 28.5,5.79 v28.5,5.81
  Bottom 0.254: v28.5,5.81 28.39,5.91 28.39,8.11 27.39,9.11 22,9.11 21.87,9.24 R2.2
N$2
  Top 0.254: R27.2 20.44,8.77 U18.3
N$3
  Bottom 0.254: PB1.6 29.67,17.79 29.48,17.6 R6.1
N$4
  Bottom 0.305: C2.2 15.93,12.18 15.74,12.37 15.26,12.85 14.62,12.85 Y1.2 14.43,13.09 14.5,13.15 15.33,13.15 16.05,13.87 U1.1
N$6
  Bottom 0.254: Y1.1 11.93,11.58 C3.2
  Bottom 0.305: Y1.1 11.93,14.14 12.88,15.1 U1.2
N$7
  Top 0.254: U9.3 10.92,1.34 10.79,1.21 R25.2
N$8
  Top 0.305: Q1.5 19.6,24.61 19.87,24.88 R10.2 R11.2
N$9  (via drill 0.25)
  Top 0.305: v25.36,27.45 25.1,27.71 20.29,27.71 20.1,27.52 19.87,27.29 R10.1
  Bottom 0.305: U3.24 26.08,27.52 25.39,27.52 25.36,27.48 v25.36,27.45
N$10
  Bottom 0.254: U1.43 20.05,11.86 20.75,11.16 C9.2
N$11
  Bottom 0.254: U3.8 17.72,33.41 R13.2
N$12  (via drill 0.25)
  Top 0.305: Q1.6 18.95,25.71 R12.2 19,24.55 17.83,24.55 17.39,25 17.39,28.17 14.39,31.17 14.39,31.52 v14.29,31.62 | v12.19,31.12 12.19,32.02 13.79,33.62 23,33.62 24,32.61 v24.87,32.61 RST.X
  Bottom 0.305: v14.29,31.62 14.48,31.43 14.48,30.62 14.18,30.31 12.39,30.31 12.1,30.62 12.1,31.02 v12.19,31.12 | U3.19 26.04,32.61 v24.87,32.61
N$13
  Bottom 0.254: D1.C 12.25,18.91 R26.2
N$15
  Bottom 0.254: U1.9 14.23,18.6 D1.A
N$16
  Bottom 0.254: D3.C1 R17.1
N$17
  Bottom 0.254: D3.C2 R16.1
N$18
  Bottom 0.254: D3.C3 R15.1
N$19  (via drill 0.25)
  Top 0.305: R14.1 18.11,28.33 18.48,28.7 v19.19,28.7
  Top 0.406: v19.19,28.7 19.19,28.21 | 19.19,28.21 19.1,28.12 | JTMS.X 19.19,28.03 19.19,28.21
  Bottom 0.406: U3.31 19.23,28.68 v19.19,28.71 v19.19,28.7
N$20  (via drill 0.25)
  Top 0.305: JTDO.X 20.36,29.63 R19.2 v20.39,28.82 v20.39,28.81
  Bottom 0.305: v20.39,28.81 20.39,28.06 U3.32
N$21  (via drill 0.25)
  Top 0.305: R18.1 16.6,20.85 16.6,22.71 16.12,23.19 | 16.12,23.21 16.12,23.19 | 16.12,23.19 16,23.31 16,27.21 13,30.21 13,31.93 13.88,32.81 18.5,32.81 18.86,32.45 20.37,32.45 20.83,31.99 20.83,31.98 22.6,30.21 22.6,29.12 23,28.71 v24.1,28.71
  Top 0.406: v24.1,28.71 22.77,28.71 JCLK.X
  Bottom 0.406: U3.35 23.63,28.45 23.89,28.71 v24.1,28.71
N$23  (via drill 0.25)
  Top 0.406: v19.29,31.12 19.29,30.62 LPO_IN.X
  Bottom 0.406: U3.5 19.12,30.54 19.29,30.71 v19.29,31.12
N$25
  Top 0.406: R21.1 19.64,14.52 D4.C
N$28
  Top 0.406: U5.1 23.56,9.59 20.03,9.59 17.59,12.02 R21.2 R20.2
N$30
  Top 0.406: U5.5 23.22,12.43 R22.1
N$31
  Top 0.305: U6.3 11.18,5.8 10.8,5.42 C20.2
N$32
  Top 0.305: C20.1 12.5,7.52 12.96,7.98 U6.6
N$33
  Top 0.305: C25.2 7.3,4.42 7.77,4.89 U7.4
N$37
  Top 0.305: C35.2 12.12,21.61 U17.10
N$39
  Top 0.305: U17.20 14.82,23.53 C37.2
N$40
  Top 0.305: 30.05,12.95 29.15,13.85
  Top 0.406: D2.1 26.14,18.86 26.89,19.62 28.52,19.62 J3.6 29.85,20.95 J3.7 J3.8 J3.9 J3.10 30.05,12.95 29.27,13.73 C38.1 29.25,11.24 R28.2 | 29.15,13.85 J3.11
N$42
  Top 0.406: D5.A 18.91,16.65 18.59,16.33 R20.1
PA02_EDA_SIG  (via drill 0.25)
  Top 0.305: v5.5,29.21 5.54,29.27 J1.2
  Bottom 0.305: U1.3 12.58,15.6 11.69,14.71 7.09,14.71 6.5,15.31 6.21,15.6 5.41,16.4 5.41,29.13 v5.5,29.21
PA07_DRDY  (via drill 0.25)
  Top 0.305: J1.18 7.13,21.3 8.62,21.3 9.21,20.71 v9.24,20.75
  Bottom 0.305: U1.12 9.81,20.1 9.19,20.71 9.23,20.75 v9.24,20.75
PA12_S2_TX_MOSI  (via drill 0.25)
  Top 0.254: v21.55,22.66 22.65,23.77 24.25,23.77 24.79,24.31 v24.79,27.12
  Bottom 0.254: U1.21 21.55,22.57 21.6,22.62 v21.55,22.66 | U3.36 24.73,27.18 v24.79,27.12
PA13_S2_RX_MISO
  Bottom 0.254: U1.22 22.05,23.06 19.6,25.52 18.29,25.52 17.86,25.95 U3.1
PA14_S2_RTS_CS  (via drill 0.25)
  Top 0.305: v25,30.52 25.69,30.52 26,30.21 26,24.81 24.1,22.91 v23.6,22.91
  Bottom 0.254: U3.28 21.98,25.17 23.6,23.55 v23.6,22.91 23.6,20.8 23.3,20.5 22.81,20.5 22.56,20.75 U1.23 | U3.21 25.02,30.54 v25,30.52
PA15_S2_CTS_SCK  (via drill 0.25)
  Top 0.305: v25,31.41 25.68,31.41 26.64,30.45 26.64,24.76 24.1,22.21 23.1,22.21 23,22.31 23,22.81 v23.05,22.81
  Bottom 0.254: U3.29 20.98,25.33 23.05,23.26 v23.05,22.81 U1.24 | U3.20 25.98,31.41 v25,31.41
PA16_S1_MOSI  (via drill 0.25)
  Top 0.254: J1.24 10.14,18.27 10.94,17.46
  Top 0.305: 10.94,17.46 20.94,17.46 23.1,19.62 v23.1,19.71 | v6.09,18.21 6.14,18.27 J1.24
  Bottom 0.305: U1.25 23.48,20.1 v23.1,19.71 | MOSI.X 6.2,18.12 v6.09,18.21
PA17_S1_SCK  (via drill 0.25)
  Top 0.305: v8.2,20.25 8.2,20.21 8.14,20.27 J1.20 6.25,20.27 v6.09,20.41
  Bottom 0.305: U1.26 23.75,19.6 23.36,19.21 22.5,19.21 21.21,20.5 16.94,20.5 16.9,20.53 10.78,20.53 10,21.31 8.79,21.31 8.2,20.71 v8.2,20.25 | SCK.X 6.09,20.91 v6.09,20.41
PA18_OTG  (via drill 0.25)
  Top 0.254: J3.4 27.71,17.6 26.89,18.41 v26.89,18.81
  Bottom 0.254: v26.89,18.81 26.61,19.1 U1.27
PA19_S1_MISO  (via drill 0.25)
  Top 0.254: 9.51,19.8 9.64,19.67 14.21,19.67 14.97,18.91 16,18.91
  Top 0.305: 15.69,18.91 16,18.91 19.29,18.91 19.83,19.45 20.56,19.45 v21.29,18.71 | 9.51,19.8 8.54,20.77 J1.19 6.64,20.77 6.09,21.31 v6.09,22.31
  Bottom 0.305: U1.28 21.41,18.6 v21.29,18.71 | v6.09,22.31 6.2,22.41 MISO.X
PA20_CS  (via drill 0.25)
  Top 0.305: v20.79,18.41 20.39,18.81 19.89,18.81 19.5,18.41 14.89,18.41 14.04,19.27 8.6,19.27 8.09,19.77 J1.21 6.45,19.77 6.39,19.71 v6.09,19.71
  Bottom 0.305: U1.29 21.11,18.1 v20.79,18.41 | v6.09,19.71 6.29,19.52 CS.X
PA27_GPIO0  (via drill 0.25)
  Top 0.305: v24.39,20.81 24.38,20.8 24.38,19.72 23.79,19.13 23.48,19.13 22.39,18.05 22.39,15.61 v22,15.21 | GPIO0.X 23.22,25.19 v23,25.41 v22.98,25.41
  Bottom 0.254: U1.39 22.1,13.15 22.1,13.91 22,14.02 v22,15.21
  Bottom 0.305: U3.27 v22.98,25.41 22.98,24.83 24.39,23.41 v24.39,20.81
PA28_ACK  (via drill 0.25)
  Top 0.254: v21.6,19.21 21.89,19.21 27.19,24.52 27.19,30.81 26.1,31.91 22.89,31.91 21.69,33.12 v19.19,33.12
  Bottom 0.254: U1.41 21.05,16.26 19.6,17.71 19.6,19.71 19.97,20.09 20.72,20.09 v21.6,19.21 | v19.19,33.12 18.62,32.54 U3.7
PA30_SWCLK  (via drill 0.25)
  Top 0.254: J8.4 26.81,4.31 24.6,4.31 v24.5,4.41
  Top 0.305: v19,20.02 18.19,20.81 18.19,22.35 16.9,23.64 16.9,27.91 v14,30.81
  Bottom 0.254: U1.45 19.05,10.86 19.29,10.61 19.29,9.3 19.44,9.15 20.75,9.15 21.29,8.61 22.6,8.61 24.19,7.02 24.19,4.71 v24.5,4.41 | R13.1 12.69,33.39 R4.1
  Bottom 0.305: U1.45 19.05,15.66 19,15.71 v19,20.02 | v14,30.81 12.69,32.12 R4.1
PA31_SWDIO  (via drill 0.25)
  Top 0.254: v24.39,1.01 26.6,1.01 27.5,1.91 27.5,3.73 J8.2
  Top 0.305: v18.29,19.91 17.69,20.52 17.69,22.24 16.47,23.46 16.47,27.44 13.5,30.41 13.5,31.81 13.89,32.21 17.89,32.21 18.1,32.02 20.19,32.02 20.39,31.81 20.39,31.52 20.39,31.51 R19.1
  Bottom 0.254: U1.46 18.55,10.65 18.79,10.41 18.79,9.1 19.24,8.65 20.45,8.65 20.99,8.11 22.39,8.11 23.69,6.81 23.69,1.71 v24.39,1.01
  Bottom 0.305: U1.46 18.55,15.26 18.29,15.52 v18.29,19.91
PB08_RST  (via drill 0.25)
  Top 0.254: Q1.2 R9.2 19.61,19.94 19.1,19.41 17.39,19.41 17.39,19.42 v17.21,19.42
  Bottom 0.254: v17.21,19.42 17.21,17.86 16.95,17.6 U1.7
PB22_S5_TX  (via drill 0.25)
  Top 0.254: v23,11.41 v23,10.17
  Bottom 0.254: U3.23 26.13,28.52 27,28.52 27.6,27.91 27.6,24.91 28.19,24.31 31.69,24.31 31.69,23.18 31.82,23.06 31.82,11.79 RX.X 30.85,10.82 30.85,10.23 30.54,9.91 23.19,9.91 23.19,9.97 v23,10.17 | U1.37 23.05,11.47 v23,11.41
PB23_S5_RX  (via drill 0.25)
  Top 0.254: v30.19,12.02 31,11.21 v32.67,11.21 32.69,11.21
  Bottom 0.254: v25,29.52 25.02,29.54 U3.22 26.97,29.54 27,29.52 27.1,29.52 28,30.41 31.5,30.41 32.67,29.24 v32.67,11.21 TX.X | U1.38 22.55,13.87 22.89,14.21 23.39,14.21 23.69,13.91 23.69,11.91 24.39,11.21 29.39,11.21 v30.19,12.02
RED  (via drill 0.25)
  Top 0.254: v29.39,32.91 27.79,34.52 v25.1,34.52
  Bottom 0.254: U3.17 26.08,34.52 v25.1,34.52 | D3.A2 29.39,32.12 v29.39,32.91
RESET#  (via drill 0.25)
  Top 0.305: Q1.3 20.89,22.35 20.89,23.12 22.29,24.51 23.85,24.51 23.86,24.52 v24.19,24.52
  Bottom 0.305: R5.2 27.88,13.53 27.39,14.02 27.39,19.39 27,19.8 27,21.71 v24.19,24.52
RESETN
  Bottom 0.305: R6.2 C1.1 R3.1 R5.1 30.68,13.33 30.68,11.6 29.73,10.65 R2.1 21.87,11.19 21.89,11.21 21.89,11.41 21.55,11.76 U1.40
S0_I2C_SCL  (via drill 0.25)
  Top 0.305: U17.23 15,25.03 v15,24.71 | J1.16 v8.34,22.27 8.39,22.31 | R14.2 18,25.71 18,25.17 v18.02,25.14
  Bottom 0.254: U1.14 18.05,22.46 17.68,22.83 17.68,23.31
  Bottom 0.305: v15,24.71 14.57,24.29 U4.6 | R8.1 16.19,23.52 v15,24.71 | 17.68,23.31 R8.1 | v8.34,22.27 8.34,23.77 10.19,25.62 10.19,25.91 10.5,26.21 10.6,26.31 15.1,26.31 15.29,26.12 15.29,25.02 v15,24.71 | 18.07,25.09 v18.02,25.14 18.07,25.09 | 18.07,25.09 18.09,25.09 18.39,24.79 18.39,23.71 18.19,23.52 R8.1
S0_I2C_SDA  (via drill 0.25)
  Top 0.305: U17.24 v14.69,25.53 15.28,25.53 15.49,25.32 15.49,23.02 v15.99,22.52 15.99,21.71 15,20.72 R18.2 15,20.24 15,20.23 10.68,20.23 9.14,21.77 J1.17
  Bottom 0.254: U4.5 13.86,25.28 14.19,25.62 14.61,25.62 v14.69,25.53
  Bottom 0.305: U1.13 17.08,21.6 R7.1 16.69,21.71 16,22.41 v16,22.51 v15.99,22.52
USBN  (via drill 0.25)
  Top 0.254: J3.2 27.41,16.3 27.1,16.61 26,16.61 25.89,16.61 | 25.89,16.61 24.86,16.61 24.44,16.19 D2.3 24.34,15.79 23.56,15.79 D-1.X | 25.89,16.61 v25.89,16.54
  Bottom 0.254: v25.89,16.54 25.46,16.1 U1.33
USBP  (via drill 0.25)
  Top 0.254: J3.3 27.3,16.95 27.25,17 26.39,17 | 26.39,17 24.94,17 24.44,17.49 D2.2 23.44,17.99 D+1.X | v26.39,17.07 26.39,17
  Bottom 0.254: U1.34 25.68,15.6 26.39,16.31 v26.39,17.07
V_BATT  (via drill 0.25)
  Top 0.19: C19.2
  Top 0.254: U9.6 14.27,3.27 C7.2 | C19.2 16.87,6.19 17.22,6.54 U18.6 | R23.2 16.15,9.77 15.1,8.71 15.1,6.52 15.42,6.19 C19.2
  Top 0.406: C7.2 v15.32,3.24 16,3.91 C19.2 15.89,6.19
  Bottom 0.406: v15.32,3.24 15.35,3.21 16.1,3.21 16.39,2.91 16.39,2.14 S1.3 S1.6
VBAT_LVL  (via drill 0.25)
  Top 0.254: C33.2 15.08,11.1 R24.2 15.2,12.2 R23.1 16.15,12.57 v16.6,13.02
  Bottom 0.254: v16.6,13.02 16.6,13.71 17.29,14.41 18,14.41 18.05,14.36 U1.47
VCC  (via drill 0.25)
  Top 0.254: J1.12 J1.11 8.44,24.77 v9.19,25.52 U17.13 | R27.1 v20.5,7.02 20.5,6.61 20.53,6.58 C18.2 19.57,6.54 19.19,6.91 19.19,7.44 U18.1 | J8.1 29.87,3.99 30.19,4.31 32.69,4.31 32.69,8.71 31,10.41 v30.39,10.41 | 18.8,27.12 18.8,27.22 v18.8,27.31 v18.79,27.31
  Top 0.305: 18.8,27.12 19,26.92 R12.1 | 18.8,27.22 18.79,27.21 | U17.8 11.12,21.74 10.89,21.52 v10.79,21.52
  Top 0.406: C36.2 11.69,28.52 C34.2 v11.67,29.19 11.69,29.21
  Bottom 0.19: 16.89,34.41 v16.89,34.91
  Bottom 0.254: C8.2 19.55,11.01 v19.55,11.41 U1.44 | R4.2 16.07,32.54 16.1,32.52 16.1,31.81 C28.2 C29.1 16.02,29.32 C30.2 C31.1 | C13.2 16.12,35.54 U3.10 | U3.9 17.73,34.41 16.89,34.41 C12.1 | U1.17 19.55,22.56 | 19.1,23.02 19.55,22.56 | C11.2 24.55,13.72 U1.36 | L3.1 6.8,15.81 7,15.61 9,15.61 9.1,15.71 9.15,15.71 v9.19,15.67 | R8.2 16.99,24.52 | 19.55,22.56 v19.55,22.63 | 16.22,26.81 14.69,26.81 14.6,26.72 v14.6,26.8
  Bottom 0.305: U4.8 13.86,22.38 13.79,22.31 | 13.79,22.31 13.31,22.31 C53.1 | R7.2 14.89,21.21 v14.75,21.37 13.79,22.31 | C10.2 19.04,23.07 19.1,23.02 | R3.2 28.49,14.45 27.89,15.04 v27.89,15.11 | C11.2 26.42,13.69 v26.79,13.31 | U3.10 U3.9
  Bottom 0.406: C14.2 17.68,11.02 v16.89,11.02 | C31.1 16.22,26.81 16.22,25.28 16.99,24.52
  pour Route15: 32.69,26.71 28.29,26.71 27.29,27.71 27.29,34.71 27.39,34.81 26.39,35.81 9.1,35.81 9.1,2.91 11.39,0.61 22.29,0.61 23.5,1.81 23.5,8.52 23.6,8.61 23.6,8.81 24.79,10.02 30.69,10.02 32.69,12.02
VDDANA
  Bottom 0.254: U1.6 15.11,17.1 14.93,17.27 C5.2 13.64,17.27 13.39,17.52 10.5,17.52 10.05,17.07 C4.2 10.02,16.62 L3.2

### Text on the board
tNames: FACIA_MAINBOARD_V0_11/21/19 | JGND | LPO_IN | RST | JTDO | JTMS | JCLK | GPIO0
bNames: MISO | SCK | CS | MOSI | 5V | GND | TX | AGND | RX | ON